# EAGLE design InkTime_Design (EAGLE 9.7.0)

## Sheet 1 of 2
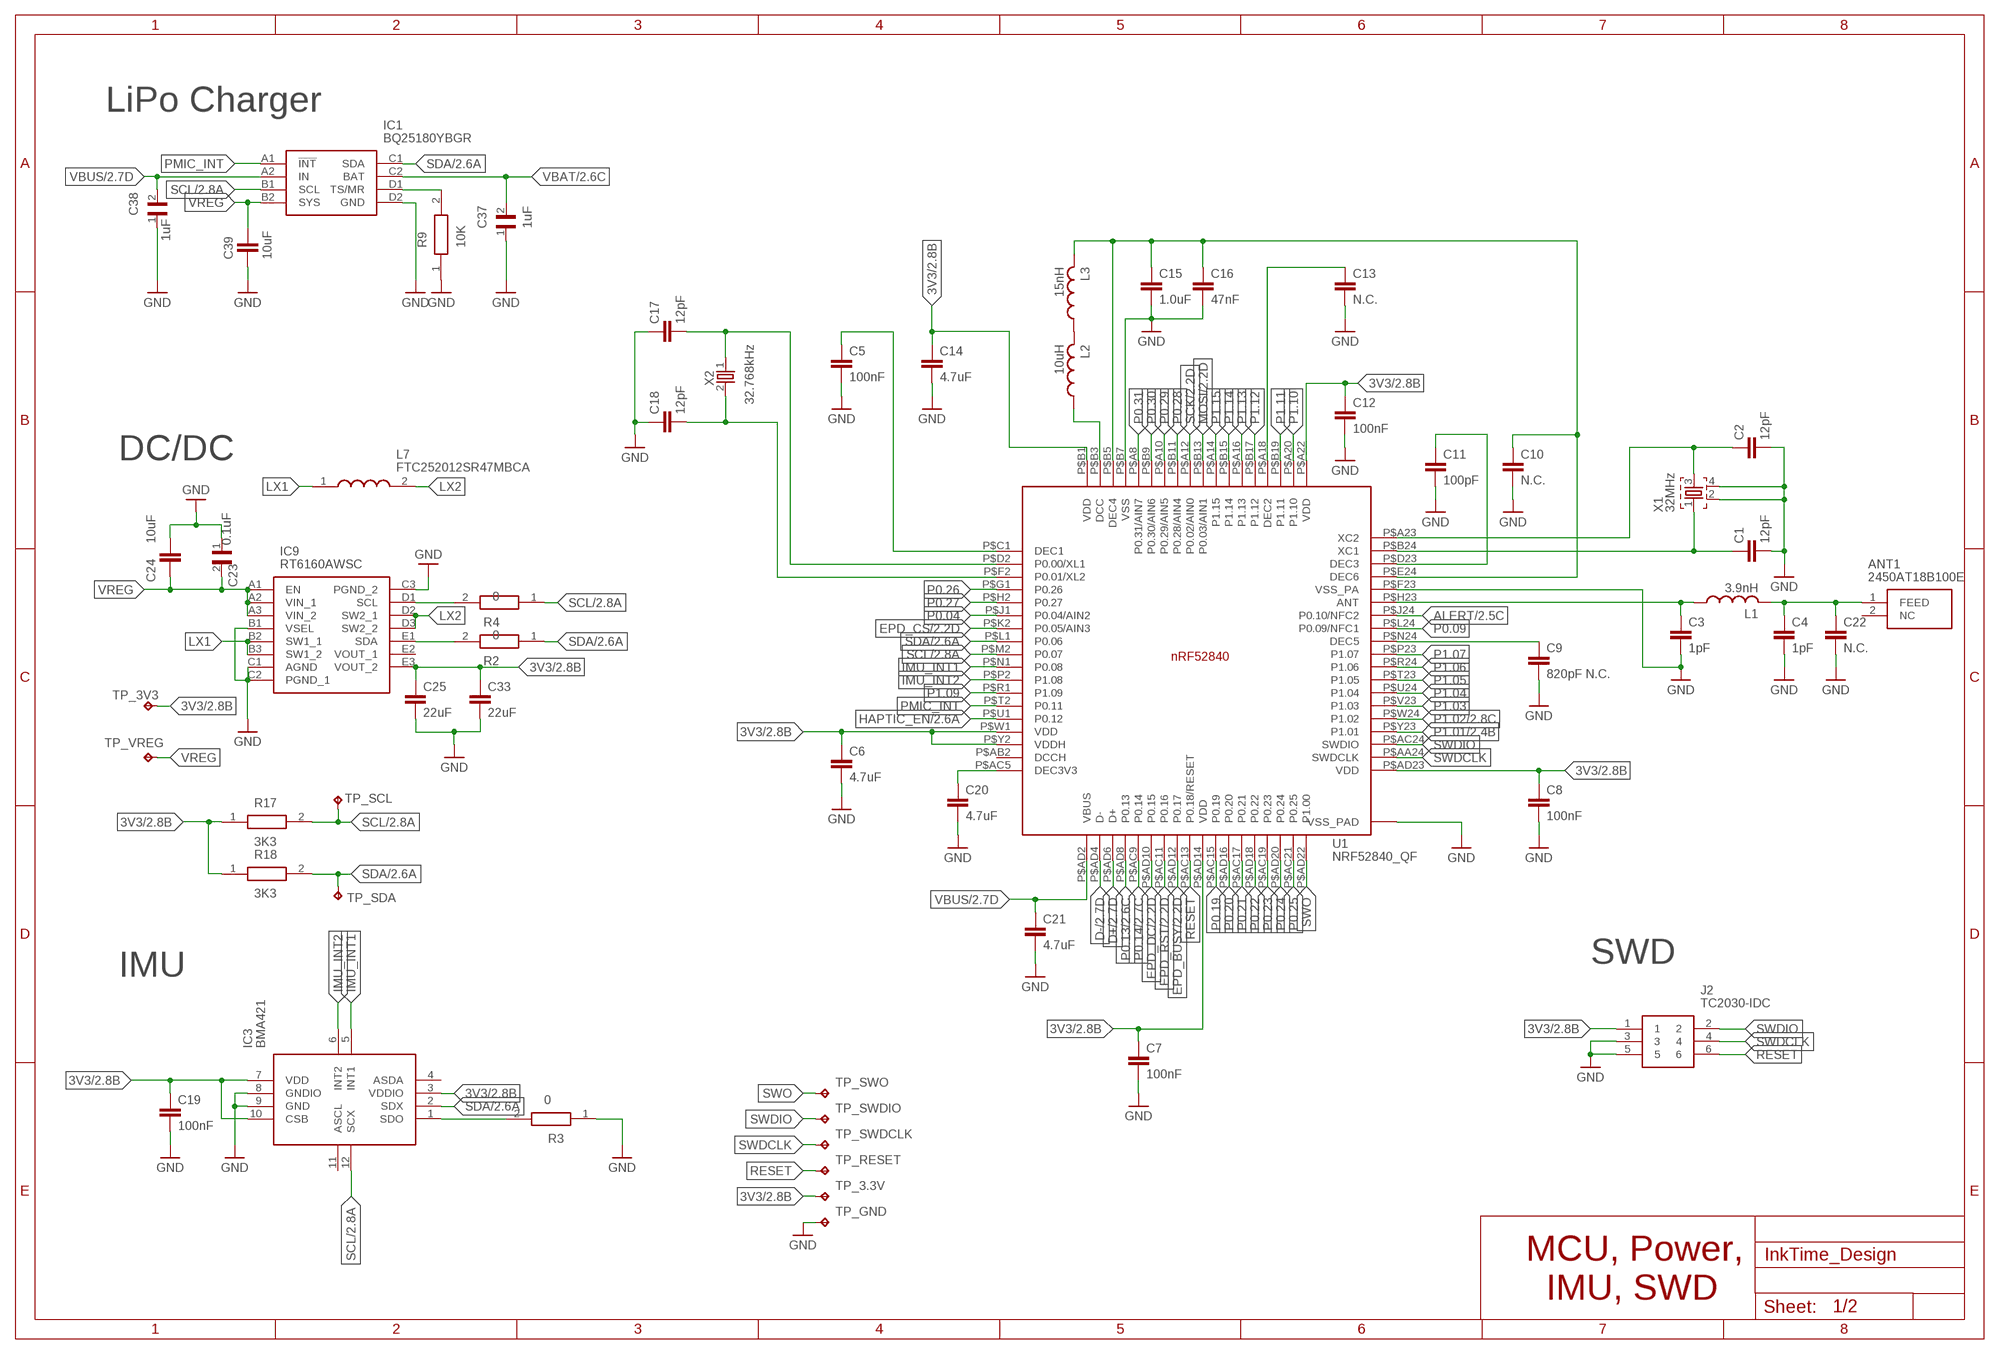
[diagram p0: schematic, sheet 1]

### Parts
ANT1  2450AT18B100E  2450AT18B100E_2450AT18B100E  [2450AT18B100E_ANTC3216X140N]
C1  12pF  NORDIC_NRF_3_CAPACITOR_0201_L  [NORDIC_NRF_3_RESC0201_L]
C2  12pF  NORDIC_NRF_3_CAPACITOR_0201_L  [NORDIC_NRF_3_RESC0201_L]
C3  1pF  NORDIC_NRF_3_CAPACITOR_0201_L  [NORDIC_NRF_3_RESC0201_L]
C4  1pF  NORDIC_NRF_3_CAPACITOR_0201_L  [NORDIC_NRF_3_RESC0201_L]
C5  100nF  NORDIC_NRF_3_CAPACITOR_0201_L  [NORDIC_NRF_3_RESC0201_L]
C6  4.7uF  NORDIC_NRF_3_CAPACITOR_0402_L  [NORDIC_NRF_3_RESC0402_L]
C7  100nF  NORDIC_NRF_3_CAPACITOR_0201_L  [NORDIC_NRF_3_RESC0201_L]
C8  100nF  NORDIC_NRF_3_CAPACITOR_0201_L  [NORDIC_NRF_3_RESC0201_L]
C9  820pF N.C.  NORDIC_NRF_3_CAPACITOR_0201_L  [NORDIC_NRF_3_RESC0201_L]
C10  N.C.  NORDIC_NRF_3_CAPACITOR_0201_L  [NORDIC_NRF_3_RESC0201_L]
C11  100pF  NORDIC_NRF_3_CAPACITOR_0201_L  [NORDIC_NRF_3_RESC0201_L]
C12  100nF  NORDIC_NRF_3_CAPACITOR_0201_L  [NORDIC_NRF_3_RESC0201_L]
C13  N.C.  NORDIC_NRF_3_CAPACITOR_0201_L  [NORDIC_NRF_3_RESC0201_L]
C14  4.7uF  NORDIC_NRF_3_CAPACITOR_0402_L  [NORDIC_NRF_3_RESC0402_L]
C15  1.0uF  NORDIC_NRF_3_CAPACITOR_0402_L  [NORDIC_NRF_3_RESC0402_L]
C16  47nF  NORDIC_NRF_3_CAPACITOR_0201_L  [NORDIC_NRF_3_RESC0201_L]
C17  12pF  NORDIC_NRF_3_CAPACITOR_0201_L  [NORDIC_NRF_3_RESC0201_L]
C18  12pF  NORDIC_NRF_3_CAPACITOR_0201_L  [NORDIC_NRF_3_RESC0201_L]
C19  100nF  NORDIC_NRF_3_CAPACITOR_0201_L  [NORDIC_NRF_3_RESC0201_L]
C20  4.7uF  NORDIC_NRF_3_CAPACITOR_0402_L  [NORDIC_NRF_3_RESC0402_L]
C21  4.7uF  NORDIC_NRF_3_CAPACITOR_0402_L  [NORDIC_NRF_3_RESC0402_L]
C22  N.C.  NORDIC_NRF_3_CAPACITOR_0201_L  [NORDIC_NRF_3_RESC0201_L]
C23  0.1uF  GRM011R60J152KE01L_2_GRM011R60J152KE01L  [GRM011R60J152KE01L_2_CAPC0201X13N]
C24  10uF  NORDIC_NRF_3_CAPACITOR_0402_L  [NORDIC_NRF_3_RESC0402_L]
C25  22uF  NORDIC_NRF_3_CAPACITOR_0402_L  [NORDIC_NRF_3_RESC0402_L]
C33  22uF  NORDIC_NRF_3_CAPACITOR_0402_L  [NORDIC_NRF_3_RESC0402_L]
C37  1uF  GRM011R60J152KE01L_2_GRM011R60J152KE01L  [GRM011R60J152KE01L_2_CAPC0201X13N]
C38  1uF  GRM011R60J152KE01L_2_GRM011R60J152KE01L  [GRM011R60J152KE01L_2_CAPC0201X13N]
C39  10uF  NORDIC_NRF_3_CAPACITOR_0402_L  [NORDIC_NRF_3_RESC0402_L]
IC1  BQ25180YBGR  BQ25180YBGR_BQ25180YBGR  [BQ25180YBGR_BGA8C40P2X4_100X155X50]
IC3  BMA421  BMA423_BMA423  [BMA423_BMA423]
IC9  RT6160AWSC  RT6160AWSC_RT6160AWSC  [RT6160AWSC_BGA15C40P3X5_140X230X60]
J2  TC2030-IDC  TC2030-IDC_TC2030-IDC  [TC2030-IDC_TC2030IDC]
L1  3.9nH  NORDIC_NRF_2_INDUCTOR_0402_L  [NORDIC_NRF_2_RESC0402_L]
L2  10uH  NORDIC_NRF_2_INDUCTOR_0402_L  [NORDIC_NRF_2_RESC0402_L]
L3  15nH  NORDIC_NRF_2_INDUCTOR_0402_L  [NORDIC_NRF_2_RESC0402_L]
L7  FTC252012SR47MBCA  MLP2016SR47MT0S1_FTC252012SR47MBCA  [MLP2016SR47MT0S1_INDC2016X100N]
R2  0  CPF0201D7K68C1_CPF0201D7K68C1  [CPF0201D7K68C1_0201]
R3  0  CPF0201D7K68C1_CPF0201D7K68C1  [CPF0201D7K68C1_0201]
R4  0  CPF0201D7K68C1_CPF0201D7K68C1  [CPF0201D7K68C1_0201]
R9  10K  CPF0201D7K68C1_CPF0201D7K68C1  [CPF0201D7K68C1_0201]
R17  3K3  CPF0201D7K68C1_CPF0201D7K68C1  [CPF0201D7K68C1_0201]
R18  3K3  CPF0201D7K68C1_CPF0201D7K68C1  [CPF0201D7K68C1_0201]
TP_3.3V  HECTOR_WATCH_1_TPTP20R  [HECTOR_WATCH_1_TP20R]
TP_3V3  HECTOR_WATCH_1_TPTP20R  [HECTOR_WATCH_1_TP20R]
TP_GND  HECTOR_WATCH_1_TPTP20R  [HECTOR_WATCH_1_TP20R]
TP_RESET  HECTOR_WATCH_1_TPTP20R  [HECTOR_WATCH_1_TP20R]
TP_SCL  HECTOR_WATCH_1_TPTP20R  [HECTOR_WATCH_1_TP20R]
TP_SDA  HECTOR_WATCH_1_TPTP20R  [HECTOR_WATCH_1_TP20R]
TP_SWDCLK  HECTOR_WATCH_1_TPTP20R  [HECTOR_WATCH_1_TP20R]
TP_SWDIO  HECTOR_WATCH_1_TPTP20R  [HECTOR_WATCH_1_TP20R]
TP_SWO  HECTOR_WATCH_1_TPTP20R  [HECTOR_WATCH_1_TP20R]
TP_VREG  HECTOR_WATCH_1_TPTP20R  [HECTOR_WATCH_1_TP20R]
U1  NRF52840_QF  NORDIC_NRF_4_NRF52840_QF  [NORDIC_NRF_4_AQFN50P700X700X85_HS-74N]
X1  32MHz  NORDIC_NRF_XTAL_32MHZ  [NORDIC_NRF_BT-XTAL_2016_N]
X2  32.768kHz  NORDIC_NRF_1_XTAL_32KHZ  [NORDIC_NRF_1_XTAL_3215_N]

### Nets
3V3 [POWER]: C6.1 C7.1 C8.1 C12.1 C14.1 C19.1 C25.1 C33.1 IC3.3(VDDIO) IC3.7(VDD) IC3.10(CSB) IC9.E3(VOUT_2) J2.1 R17.1 R18.1 TP_3.3V.TP TP_3V3.TP U1.P$A22(VDD) U1.P$AD14(VDD) U1.P$AD23(VDD) U1.P$B1(VDD) U1.P$W1(VDD) U1.P$Y2(VDDH) ; also sheet 2
ALERT: U1.P$J24(P0.10/NFC2) ; also sheet 2
D+: U1.P$AD6(D+) ; also sheet 2
D-: U1.P$AD4(D-) ; also sheet 2
EPD_BUSY: U1.P$AD12(P0.17) ; also sheet 2
EPD_CS: U1.P$K2(P0.05/AIN3) ; also sheet 2
EPD_DC: U1.P$AD10(P0.15) ; also sheet 2
EPD_RST: U1.P$AC11(P0.16) ; also sheet 2
GND: C1.2 C2.2 C3.2 C4.2 C5.2 C6.2 C7.2 C8.2 C9.2 C10.2 C11.2 C12.2 C13.2 C14.2 C15.2 C16.2 C17.1 C18.1 C19.2 C20.2 C21.2 C22.2 C23.1 C24.1 C25.2 C33.2 C37.1 C38.1 C39.2 IC1.D2(GND) IC3.8(GNDIO) IC3.9(GND) IC9.B1(VSEL) IC9.C1(AGND) IC9.C2(PGND_1) IC9.C3(PGND_2) J2.3 J2.5 R3.1 R9.1 TP_GND.TP U1.P$74(VSS_PAD) U1.P$75(VSS_PAD) U1.P$76(VSS_PAD) U1.P$77(VSS_PAD) U1.P$78(VSS_PAD) U1.P$79(VSS_PAD) U1.P$80(VSS_PAD) U1.P$81(VSS_PAD) U1.P$82(VSS_PAD) U1.P$83(VSS_PAD) U1.P$84(VSS_PAD) U1.P$85(VSS_PAD) U1.P$86(VSS_PAD) U1.P$87(VSS_PAD) U1.P$88(VSS_PAD) U1.P$89(VSS_PAD) U1.P$90(VSS_PAD) U1.P$B7(VSS) U1.P$F23(VSS_PA) X1.2 X1.4 ; also sheet 2
HAPTIC_EN: U1.P$U1(P0.12) ; also sheet 2
IMU_INT1: IC3.5(INT1) U1.P$N1(P0.08)
IMU_INT2: IC3.6(INT2) U1.P$P2(P1.08)
LX1: IC9.B2(SW1_1) IC9.B3(SW1_2) L7.1
LX2: IC9.D2(SW2_1) IC9.D3(SW2_2) L7.2
MOSI: U1.P$B13(P0.03/AIN1) ; also sheet 2
N$1: IC9.D1(SCL) R4.2
N$2: IC9.E1(SDA) R2.2
N$3: IC3.1(SDO) R3.2
N$4: IC1.D1(TS/MR) R9.2
N$5: C9.1 U1.P$N24(DEC5)
N$6: ANT1.1(FEED) C4.1 C22.1 L1.2
N$7: C3.1 L1.1 U1.P$H23(ANT)
N$8: C1.1 U1.P$B24(XC1) X1.1
N$9: C2.1 U1.P$A23(XC2) X1.3
N$10: C11.1 U1.P$D23(DEC3)
N$11: C13.1 U1.P$A18(DEC2)
N$12: L2.2 L3.1
N$13: L2.1 U1.P$B3(DCC)
N$14: C10.1 C15.1 C16.1 L3.2 U1.P$B5(DEC4) U1.P$E24(DEC6)
N$15: C17.2 U1.P$D2(P0.00/XL1) X2.1
N$16: C5.1 U1.P$C1(DEC1)
N$17: C18.2 U1.P$F2(P0.01/XL2) X2.2
N$18: C20.1 U1.P$AC5(DEC3V3)
P0.04: U1.P$J1(P0.04/AIN2)
P0.09: U1.P$L24(P0.09/NFC1)
P0.13: U1.P$AD8(P0.13) ; also sheet 2
P0.14: U1.P$AC9(P0.14) ; also sheet 2
P0.19: U1.P$AC15(P0.19)
P0.20: U1.P$AD16(P0.20)
P0.21: U1.P$AC17(P0.21)
P0.22: U1.P$AD18(P0.22)
P0.23: U1.P$AC19(P0.23)
P0.24: U1.P$AD20(P0.24)
P0.25: U1.P$AC21(P0.25)
P0.26: U1.P$G1(P0.26)
P0.27: U1.P$H2(P0.27)
P0.28: U1.P$B11(P0.28/AIN4)
P0.29: U1.P$A10(P0.29/AIN5)
P0.30: U1.P$B9(P0.30/AIN6)
P0.31: U1.P$A8(P0.31/AIN7)
P1.01: U1.P$Y23(P1.01) ; also sheet 2
P1.02: U1.P$W24(P1.02) ; also sheet 2
P1.03: U1.P$V23(P1.03)
P1.04: U1.P$U24(P1.04)
P1.05: U1.P$T23(P1.05)
P1.06: U1.P$R24(P1.06)
P1.07: U1.P$P23(P1.07)
P1.09: U1.P$R1(P1.09)
P1.10: U1.P$A20(P1.10)
P1.11: U1.P$B19(P1.11)
P1.12: U1.P$B17(P1.12)
P1.13: U1.P$A16(P1.13)
P1.14: U1.P$B15(P1.14)
P1.15: U1.P$A14(P1.15)
PMIC_INT: IC1.A1(!INT) U1.P$T2(P0.11)
RESET: J2.6 TP_RESET.TP U1.P$AC13(P0.18/RESET)
SCK: U1.P$A12(P0.02/AIN0) ; also sheet 2
SCL: IC1.B1(SCL) IC3.12(SCX) R4.1 R17.2 TP_SCL.TP U1.P$M2(P0.07) ; also sheet 2
SDA: IC1.C1(SDA) IC3.2(SDX) R2.1 R18.2 TP_SDA.TP U1.P$L1(P0.06) ; also sheet 2
SWDCLK: J2.4 TP_SWDCLK.TP U1.P$AA24(SWDCLK)
SWDIO: J2.2 TP_SWDIO.TP U1.P$AC24(SWDIO)
SWO: TP_SWO.TP U1.P$AD22(P1.00)
VBAT [POWER]: C37.2 IC1.C2(BAT) ; also sheet 2
VBUS [POWER]: C21.1 C38.2 IC1.A2(IN) U1.P$AD2(VBUS) ; also sheet 2
VREG [POWER]: C23.2 C24.2 C39.1 IC1.B2(SYS) IC9.A1(EN) IC9.A2(VIN_1) IC9.A3(VIN_2) TP_VREG.TP
Unconnected: ANT1.2(NC) IC3.4(ASDA) IC3.11(ASCL) IC9.E2(VOUT_1) U1.P$AB2(DCCH)

### Notes on the sheet
- LiPo Charger
- DC/DC
- SWD
- IMU
- MCU, Power,
    IMU, SWD

## Sheet 2 of 2
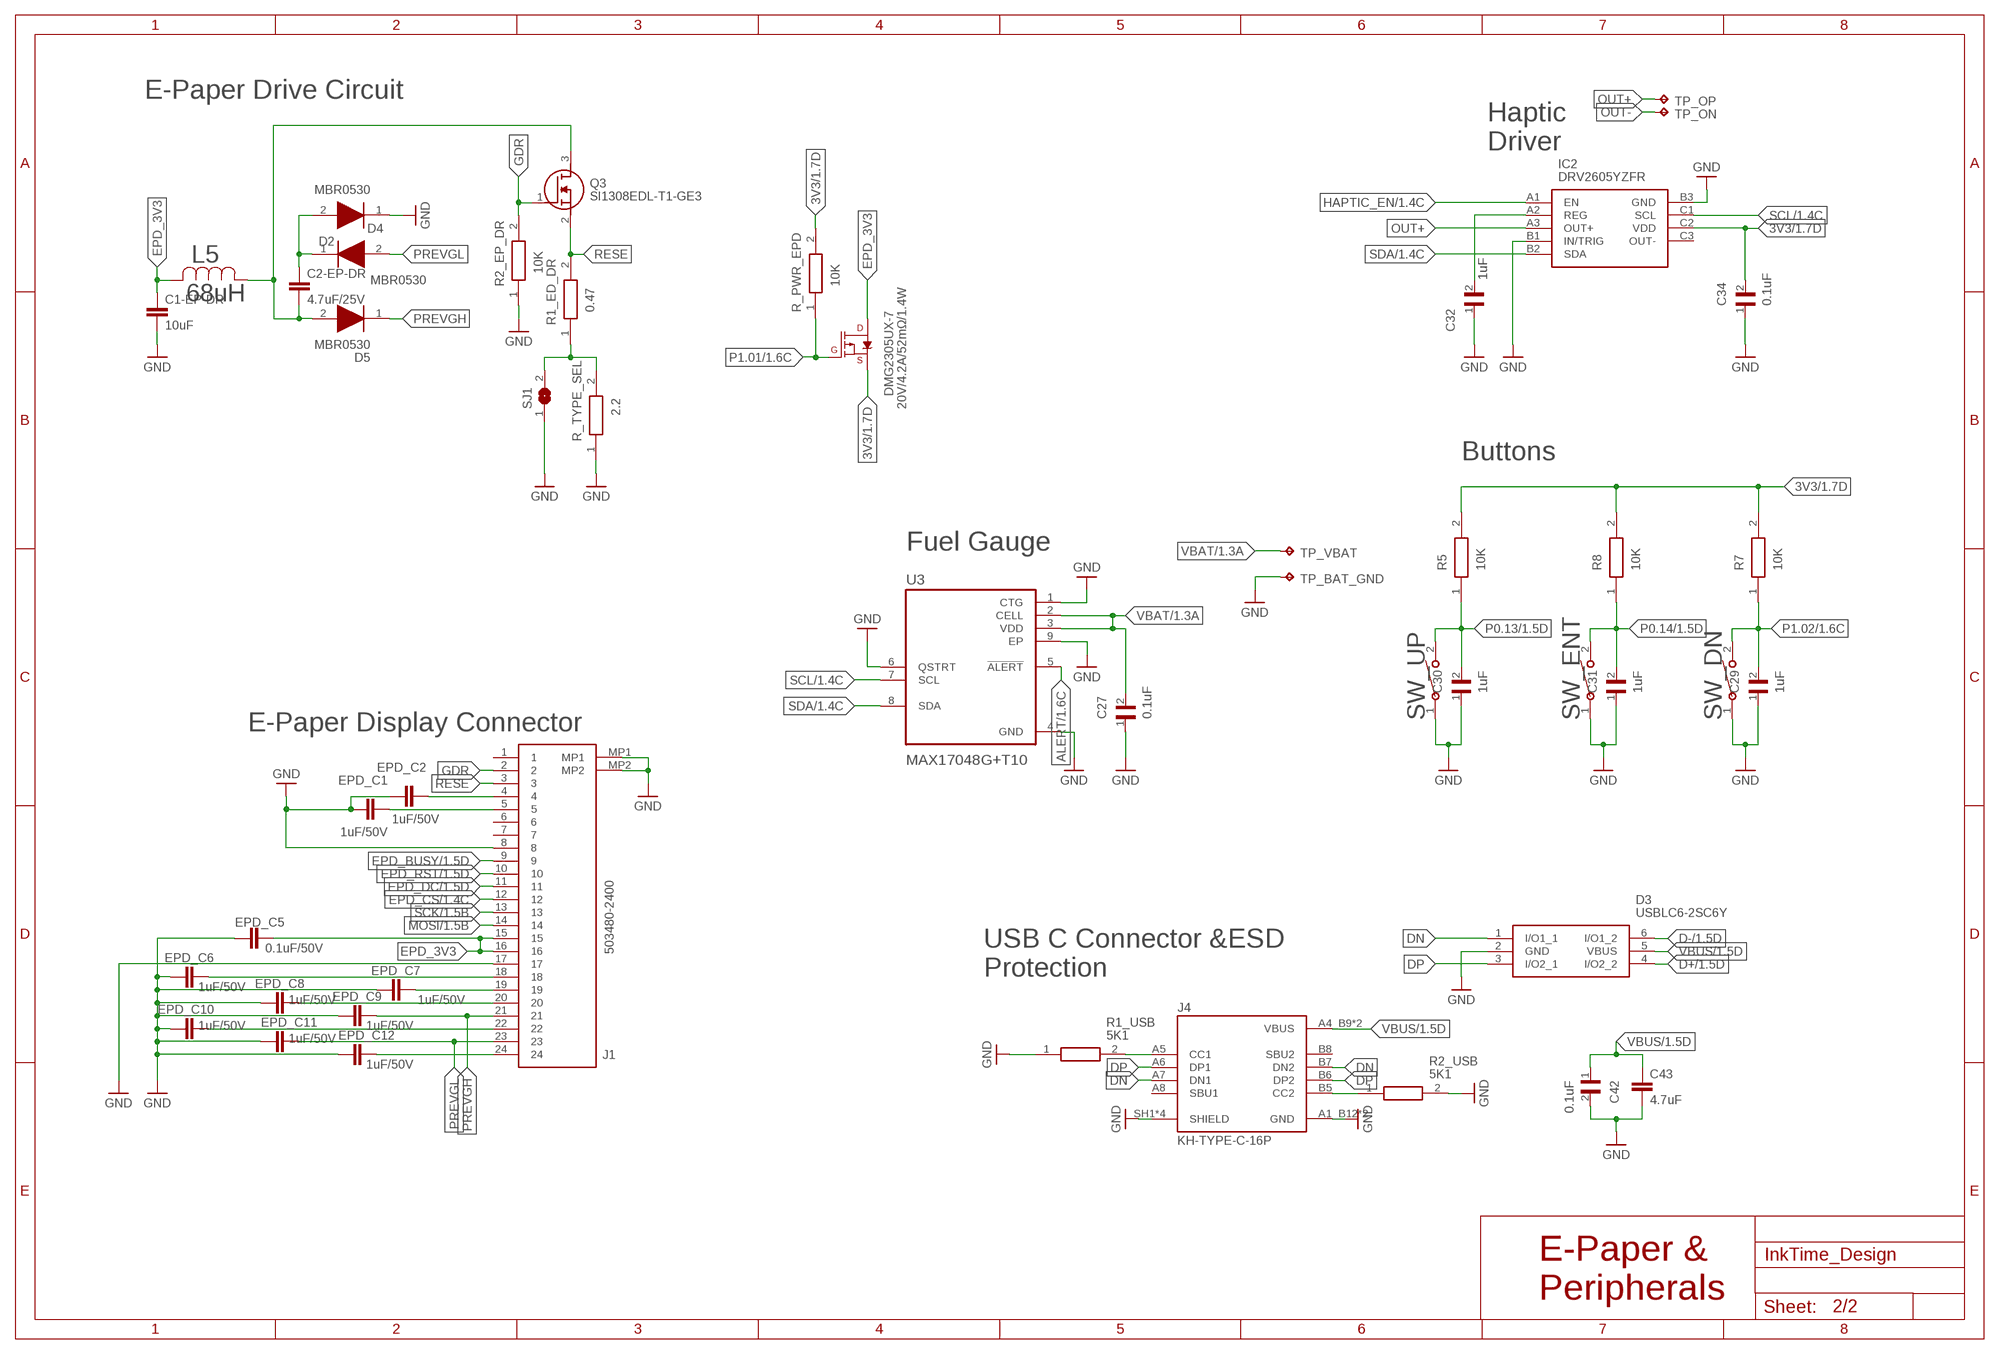
[diagram p1: schematic, sheet 2]

### Parts
C1-EP-DR  10uF  NORDIC_NRF_3_CAPACITOR_0402_L  [NORDIC_NRF_3_RESC0402_L]
C2-EP-DR  4.7uF/25V  NORDIC_NRF_3_CAPACITOR_0402_L  [NORDIC_NRF_3_RESC0402_L]
C27  0.1uF  GRM011R60J152KE01L_1_GRM011R60J152KE01L  [GRM011R60J152KE01L_1_0201]
C29  1uF  GRM011R60J152KE01L_1_GRM011R60J152KE01L  [GRM011R60J152KE01L_1_0201]
C30  1uF  GRM011R60J152KE01L_1_GRM011R60J152KE01L  [GRM011R60J152KE01L_1_0201]
C31  1uF  GRM011R60J152KE01L_1_GRM011R60J152KE01L  [GRM011R60J152KE01L_1_0201]
C32  1uF  GRM011R60J152KE01L_1_GRM011R60J152KE01L  [GRM011R60J152KE01L_1_0201]
C34  0.1uF  GRM011R60J152KE01L_1_GRM011R60J152KE01L  [GRM011R60J152KE01L_1_0201]
C42  0.1uF  GRM011R60J152KE01L_1_GRM011R60J152KE01L  [GRM011R60J152KE01L_1_0201]
C43  4.7uF  NORDIC_NRF_3_CAPACITOR_0402_L  [NORDIC_NRF_3_RESC0402_L]
D2  MBR0530  ESP32_C6_LIBRARY_5_MBR0530  [ESP32_C6_LIBRARY_5_SOD3716X135N]
D3  USBLC6-2SC6Y  ESP32_C6_LIBRARY_3_USBLC6-2SC6Y  [ESP32_C6_LIBRARY_3_SOT95P280X145-6N]
D4  MBR0530  ESP32_C6_LIBRARY_5_MBR0530  [ESP32_C6_LIBRARY_5_SOD3716X135N]
D5  MBR0530  ESP32_C6_LIBRARY_5_MBR0530  [ESP32_C6_LIBRARY_5_SOD3716X135N]
DMG2305UX-7  20V/4.2A/52mΩ/1.4W  ESP32_C6_LIBRARY_4_ESP32_WROVER_SPARKFUN-DISCRETESEMI_MOSFET_PCH-DMG2305UX-7  [ESP32_C6_LIBRARY_4_ESP32_C6_LIBRARY_4_ESP32_C6_LIBRARY_4_ESP32_C6_LIBRARY_4_ESP32_WROVER_SPARKFUN-DISCRETESEMI_SOT23-3]
EPD_C1  1uF/50V  NORDIC_NRF_3_CAPACITOR_0402_L  [NORDIC_NRF_3_RESC0402_L]
EPD_C2  1uF/50V  NORDIC_NRF_3_CAPACITOR_0402_L  [NORDIC_NRF_3_RESC0402_L]
EPD_C5  0.1uF/50V  NORDIC_NRF_3_CAPACITOR_0402_L  [NORDIC_NRF_3_RESC0402_L]
EPD_C6  1uF/50V  NORDIC_NRF_3_CAPACITOR_0402_L  [NORDIC_NRF_3_RESC0402_L]
EPD_C7  1uF/50V  NORDIC_NRF_3_CAPACITOR_0402_L  [NORDIC_NRF_3_RESC0402_L]
EPD_C8  1uF/50V  NORDIC_NRF_3_CAPACITOR_0402_L  [NORDIC_NRF_3_RESC0402_L]
EPD_C9  1uF/50V  NORDIC_NRF_3_CAPACITOR_0402_L  [NORDIC_NRF_3_RESC0402_L]
EPD_C10  1uF/50V  NORDIC_NRF_3_CAPACITOR_0402_L  [NORDIC_NRF_3_RESC0402_L]
EPD_C11  1uF/50V  NORDIC_NRF_3_CAPACITOR_0402_L  [NORDIC_NRF_3_RESC0402_L]
EPD_C12  1uF/50V  NORDIC_NRF_3_CAPACITOR_0402_L  [NORDIC_NRF_3_RESC0402_L]
IC2  DRV2605YZFR  DRV2605YZFR_DRV2605YZFR  [DRV2605YZFR_BGA9C50P3X3_144X144X62]
J1  503480-2400  503480-2400_503480-2400  [503480-2400_5034802400]
J4  KH-TYPE-C-16P  KH-TYPE-C-16P_KH-TYPE-C-16P  [KH-TYPE-C-16P_KINGHELM_KH-TYPE-C-16P]
L5  68uH  ESP32_C6_LIBRARY_2_744043680IND_4828-WE-TPC_WRE  [ESP32_C6_LIBRARY_2_IND_4828-WE-TPC_WRE]
Q3  SI1308EDL-T1-GE3  ESP32_C6_LIBRARY_6_SI1308EDL-T1-GE3  [ESP32_C6_LIBRARY_6_SOT65P210X110-3N]
R1_ED_DR  0.47  CPF0201D7K68C1_CPF0201D7K68C1  [CPF0201D7K68C1_0201]
R1_USB  5K1  CPF0201D7K68C1_CPF0201D7K68C1  [CPF0201D7K68C1_0201]
R2_EP_DR  10K  CPF0201D7K68C1_CPF0201D7K68C1  [CPF0201D7K68C1_0201]
R2_USB  5K1  CPF0201D7K68C1_CPF0201D7K68C1  [CPF0201D7K68C1_0201]
R5  10K  CPF0201D7K68C1_CPF0201D7K68C1  [CPF0201D7K68C1_0201]
R7  10K  CPF0201D7K68C1_CPF0201D7K68C1  [CPF0201D7K68C1_0201]
R8  10K  CPF0201D7K68C1_CPF0201D7K68C1  [CPF0201D7K68C1_0201]
R_PWR_EPD  10K  CPF0201D7K68C1_CPF0201D7K68C1  [CPF0201D7K68C1_0201]
R_TYPE_SEL  2.2  CPF0201D7K68C1_CPF0201D7K68C1  [CPF0201D7K68C1_0201]
SJ1  ESP32_C6_LIBRARY_7_JUMPER_SJ  [ESP32_C6_LIBRARY_7_JUMPER_SJ]
SW_DN  2025-10-22_07-23-44_LIBRARY_EVP-AKE31ASW_EVP-AKE31A_PAN  [2025-10-22_07-23-44_LIBRARY_SW_EVP-AKE31A_PAN]
SW_ENT  2025-10-22_07-23-44_LIBRARY_EVP-AKE31ASW_EVP-AKE31A_PAN  [2025-10-22_07-23-44_LIBRARY_SW_EVP-AKE31A_PAN]
SW_UP  2025-10-22_07-23-44_LIBRARY_EVP-AKE31ASW_EVP-AKE31A_PAN  [2025-10-22_07-23-44_LIBRARY_SW_EVP-AKE31A_PAN]
TP_BAT_GND  HECTOR_WATCH_1_TPTP20R  [HECTOR_WATCH_1_TP20R]
TP_ON  HECTOR_WATCH_1_TPTP20R  [HECTOR_WATCH_1_TP20R]
TP_OP  HECTOR_WATCH_1_TPTP20R  [HECTOR_WATCH_1_TP20R]
TP_VBAT  HECTOR_WATCH_1_TPTP20R  [HECTOR_WATCH_1_TP20R]
U3  MAX17048G+T10  ESP32_C6_LIBRARY_MAX17048G+T10  [ESP32_C6_LIBRARY_SON50P200X200X80-9N]

### Nets
3V3 [POWER]: C34.2 DMG2305UX-7.2(S) IC2.C2(VDD) R5.2 R7.2 R8.2 R_PWR_EPD.2 ; also sheet 1
ALERT: U3.5(!ALERT) ; also sheet 1
D+: D3.4(I/O2_2) ; also sheet 1
D-: D3.6(I/O1_2) ; also sheet 1
DN: D3.1(I/O1_1) J4.A7(DN1) J4.B7(DN2)
DP: D3.3(I/O2_1) J4.A6(DP1) J4.B6(DP2)
EPD_3V3 [POWER]: C1-EP-DR.1 DMG2305UX-7.3(D) EPD_C5.2 J1.15 J1.16 L5.2
EPD_BUSY: J1.9 ; also sheet 1
EPD_CS: J1.12 ; also sheet 1
EPD_DC: J1.11 ; also sheet 1
EPD_RST: J1.10 ; also sheet 1
GDR: J1.2 Q3.1(G) R2_EP_DR.2
GND: C1-EP-DR.2 C27.1 C29.1 C30.1 C31.1 C32.1 C34.1 C42.2 C43.2 D3.2(GND) D4.1(K) EPD_C1.1 EPD_C2.1 EPD_C5.1 EPD_C6.1 EPD_C7.1 EPD_C8.1 EPD_C9.1 EPD_C10.1 EPD_C11.1 EPD_C12.1 IC2.B1(IN/TRIG) IC2.B3(GND) J1.8 J1.17 J1.MP1 J1.MP2 J4.A1_B12(GND) J4.A12_B1(GND) J4.SH1(SHIELD) J4.SH2(SHIELD) J4.SH3(SHIELD) J4.SH4(SHIELD) R1_USB.1 R2_EP_DR.1 R2_USB.2 R_TYPE_SEL.1 SJ1.1 SW_DN.1 SW_ENT.1 SW_UP.1 TP_BAT_GND.TP U3.1(CTG) U3.4(GND) U3.6(QSTRT) U3.9(EP) ; also sheet 1
HAPTIC_EN: IC2.A1(EN) ; also sheet 1
MOSI: J1.14 ; also sheet 1
N$19: C2-EP-DR.2 D5.2(A) L5.1 Q3.3(D)
N$20: C2-EP-DR.1 D2.1(K) D4.2(A)
N$21: R1_ED_DR.1 R_TYPE_SEL.2 SJ1.2
N$22: EPD_C2.2 J1.4
N$23: EPD_C1.2 J1.5
N$24: C32.2 IC2.A2(REG)
N$25: J4.A5(CC1) R1_USB.2
N$26: EPD_C6.2 J1.18
N$27: EPD_C7.2 J1.19
N$28: EPD_C10.2 J1.22
N$29: EPD_C8.2 J1.20
N$30: J4.B5(CC2) R2_USB.1
N$32: EPD_C12.2 J1.24
OUT+: IC2.A3(OUT+) TP_OP.TP
OUT-: TP_ON.TP
P0.13: C30.2 R5.1 SW_UP.2 ; also sheet 1
P0.14: C31.2 R8.1 SW_ENT.2 ; also sheet 1
P1.01: DMG2305UX-7.1(G) R_PWR_EPD.1 ; also sheet 1
P1.02: C29.2 R7.1 SW_DN.2 ; also sheet 1
PREVGH: D5.1(K) EPD_C9.2 J1.21
PREVGL: D2.2(A) EPD_C11.2 J1.23
RESE: J1.3 Q3.2(S) R1_ED_DR.2
SCK: J1.13 ; also sheet 1
SCL: IC2.C1(SCL) U3.7(SCL) ; also sheet 1
SDA: IC2.B2(SDA) U3.8(SDA) ; also sheet 1
VBAT [POWER]: C27.2 TP_VBAT.TP U3.2(CELL) U3.3(VDD) ; also sheet 1
VBUS [POWER]: C42.1 C43.1 D3.5(VBUS) J4.A4_B9(VBUS) J4.A9_B4(VBUS) ; also sheet 1
Unconnected: IC2.C3(OUT-) J1.1 J1.6 J1.7 J4.A8(SBU1) J4.B8(SBU2)

### Notes on the sheet
- E-Paper Drive Circuit
- Haptic
  Driver
- Buttons
- Fuel Gauge
- E-Paper Display Connector
- USB C Connector &ESD
  Protection
- E-Paper &
  Peripherals

## Library data of the parts
ANT1 = InkTime_v5:2450AT18B100E_2450AT18B100E: Antennas 2.45GHz ANTENNA Source: Datasheet <https://www.johansontechnology.com/datasheets/2450AT18B100/2450AT18B100.pdf>
C1 C1-EP-DR C2 C2-EP-DR C3-C22 C24 C25 C33 C39 C43 EPD_C1 EPD_C2 EPD_C5-EPD_C12 = InkTime_v5:NORDIC_NRF_3_CAPACITOR: Generic chip capacitor
C23 C37 C38 = InkTime_v5:GRM011R60J152KE01L_2_GRM011R60J152KE01L: Check availability <https://pricing.snapeda.com/parts/GRM011R60J152KE01L/Murata/view-part?ref=eda>
C27 C29-C32 C34 C42 = InkTime_v5:GRM011R60J152KE01L_1_GRM011R60J152KE01L: Check availability <https://pricing.snapeda.com/parts/GRM011R60J152KE01L/Murata/view-part?ref=eda>
D2 D4 D5 = InkTime_v5:ESP32_C6_LIBRARY_5_MBR0530: ON SEMICONDUCTOR - MBR0530 - DIODE, SCHOTTKY, 0.5A, 30V, SOD-123 Source: Datasheet <http://www.onsemi.com/pub/Collateral/MBR0530T1-D.PDF> Check availability <https://pricing.snapeda.com/parts/MBR0530/ON%20Semiconductor/view-part?ref=eda>
D3 = InkTime_v5:ESP32_C6_LIBRARY_3_USBLC6-2SC6Y: Low Cap. ESD Protection Auto SOT-23-6 STMicroelectronics USBLC6-2SC6Y, Dual Uni-Directional TVS Diode Array, 6-Pin SOT-23 Source: Datasheet <https://componentsearchengine.com/Datasheets/1/USBLC6-2SC6Y.pdf> Check availability <https://pricing.snapeda.com/parts/USBLC6-2SC6Y/STMicroelectronics/view-part?ref=eda>
DMG2305UX-7 = InkTime_v5:ESP32_C6_LIBRARY_4_ESP32_WROVER_SPARKFUN-DISCRETESEMI_MOSFET_PCH: P-channel MOSFETs Voltage controlled devices that allow control of high current outputs. SparkFun Products: SparkFun ESP32 Thing <https://www.sparkfun.com/products/13907> SparkFun ESP8266 Thing <https://www.sparkfun.com/products/13231> SparkFun Pi Servo HAT V2 <https://www.sparkfun.com/products/15316> DMG2305UX-7 (20V/4.2A/SOT23-3)
IC1 = InkTime_v5:BQ25180YBGR_BQ25180YBGR: Charger IC Lithium Ion/Polymer, Lithium Iron Phosphate 8-DSBGA (1.6x1.1) Source: Datasheet <https://www.ti.com/lit/ds/symlink/bq25180.pdf?ts=1650264094470&ref_url=https%3A%2F%2Fwww.ti.com%2Fproduct%2FBQ25180>
IC2 = InkTime_v5:DRV2605YZFR_DRV2605YZFR: Haptic Driver for ERM/LRA with Built-In Library and Smart Loop Architecture Source: Datasheet <http://www.ti.com/lit/gpn/drv2605>
IC3 = InkTime_v5:BMA423_BMA423: Accelerometers Triaxial low-g 12bit Acceleration Sensor Source: Datasheet <https://www.mouser.com/datasheet/2/783/BST-BMA423-DS000-1509600.pdf>
IC9 = InkTime_v5:RT6160AWSC_RT6160AWSC: Buck-Boost Regulator Positive Output Step-Up/Step-Down I2C DC-DC Controller IC 15-WL-CSP (BSC) (1.4x2.3) Source: Datasheet <https://www.richtek.com/SaveDownload.aspx?specid=RT6160A>
J1 = InkTime_v5:503480-2400_503480-2400: FFC & FPC Connectors 0.5mm FPC RA SMT Dual Contact 24Ckt Source: Datasheet <https://componentsearchengine.com/Datasheets/1/503480-2400.pdf>
J2 = InkTime_v5:TC2030-IDC_TC2030-IDC: CABLE ADAPTER 6 POS Source: Datasheet <https://datasheet.datasheetarchive.com/originals/distributors/Datasheets_SAMA/62bc384e093448baaaa63dbd0b9d8707.pdf>
J4 = InkTime_v5:KH-TYPE-C-16P_KH-TYPE-C-16P: Check availability <https://pricing.snapeda.com/parts/KH-TYPE-C-16P/kinghelm/view-part?ref=eda>
L1-L3 = InkTime_v5:NORDIC_NRF_2_INDUCTOR: Generic chip inductor
L5 = InkTime_v5:ESP32_C6_LIBRARY_2_744043680
L7 = InkTime_v5:MLP2016SR47MT0S1_FTC252012SR47MBCA: SMD / SMT Inductors (Coils), L=0.47?H, L x W x T : Source: Datasheet <https://product.tdk.com/system/files/dam/doc/product/inductor/inductor/smd/catalog/inductor_commercial_power_mlp2016_en.pdf>
Q3 = InkTime_v5:ESP32_C6_LIBRARY_6_SI1308EDL-T1-GE3: MOSFET N-Ch 30V 1.5A TrenchFET SC70 Vishay Si1308EDL-T1-GE3 N-channel MOSFET Transistor, 1.5 A, 30 V, 3-Pin SC-70 Source: Datasheet <https://componentsearchengine.com/Datasheets/1/SI1308EDL-T1-GE3.pdf> Check availability <https://pricing.snapeda.com/parts/SI1308EDL-T1-GE3/Vishay%20Siliconix/view-part?ref=eda>
R1_ED_DR R2 R2_EP_DR R2_USB R3-R5 R7-R9 R17 R18 R_PWR_EPD R_TYPE_SEL = InkTime_v5:CPF0201D7K68C1_CPF0201D7K68C1: 7.68k 0201 Thin Film Surface Mount Fixed Resistor +/-0.5% 0.031W CPF0201D7K68C1 Source: Datasheet <http://www.te.com/commerce/DocumentDelivery/DDEController?Action=showdoc&DocId=Data Sheet1773200-1ApdfEnglishENG_DS_1773200-1_A.pdf4-2176215-6>
R1_USB = InkTime_v5:CPF0201D7K68C1_CPF0201D7K68C1: 7.68k 0201 Thin Film Surface Mount Fixed Resistor +/-0.5% 0.031W CPF0201D7K68C1 Source: Datasheet <http://www.te.com/commerce/DocumentDelivery/DDEController?Action=showdoc&DocId=Data Sheet1773200-1ApdfEnglishENG_DS_1773200-1_A.pdf4-2176215-6>; SPICEPREFIX: R
SJ1 = InkTime_v5:ESP32_C6_LIBRARY_7_JUMPER_SJ: SMD solder JUMPER
SW_DN SW_ENT SW_UP = InkTime_v5:2025-10-22_07-23-44_LIBRARY_EVP-AKE31A
TP_3.3V TP_3V3 TP_BAT_GND TP_GND TP_ON TP_OP TP_RESET TP_SCL TP_SDA TP_SWDCLK TP_SWDIO TP_SWO TP_VBAT TP_VREG = InkTime_v5:HECTOR_WATCH_1_TP: Test pad
U1 = InkTime_v5:NORDIC_NRF_4_NRF52840_QF: nRF52840 Features Advanced Single chip 2.4 GHz multi-protocol SoC 32-bit ARM Cortex-M4F Processor 1.7v to 5.5v operation 1MB flash + 256kB RAM Bluetooth 5 support for long range and high throughput 802.15.4 radio support On-chip NFC PPI –Programmable Peripheral Interconnect Automated power management system with automatic power management of each peripheral Configurable I/O mapping for analog and digital I/O 48 x GPIO 1 x QSPI 4 x Master/Slave SPI 2 x Two-wire interface (I²C) I²S interface 2 x UART 4 x PWM USB 2.0 controller ARM TrustZone CryptoCell-310 Cryptographic and security module AES 128-bit ECB/CCM/AAR hardware accelerator Digital microphone interface (PDM) Quadrature decoder 12-bit ADC Low power comparator On-chip 50Ω balun On-air compatible with nRF52, nRF51 and nRF24 Series Applications Advanced high performance wearables Wearables for secure payments Virtual Reality/Augmented Reality systems Smart Home sensor networks Smart city sensor networks High performance HID controllers Internet of Things (IoT) sensor networks Smart door locks Smart lighting networks Connected white goods
U3 = InkTime_v5:ESP32_C6_LIBRARY_MAX17048G+T10: Check availability <https://pricing.snapeda.com/parts/MAX17048G%2BT10/Analog%20Devices/view-part?ref=eda>
X1 = InkTime_v5:NORDIC_NRF_XTAL_32MHZ
X2 = InkTime_v5:NORDIC_NRF_1_XTAL_32KHZ

## Net classes
0 default: width 0.15 mm
1 POWER: width 0.3 mm

## Board
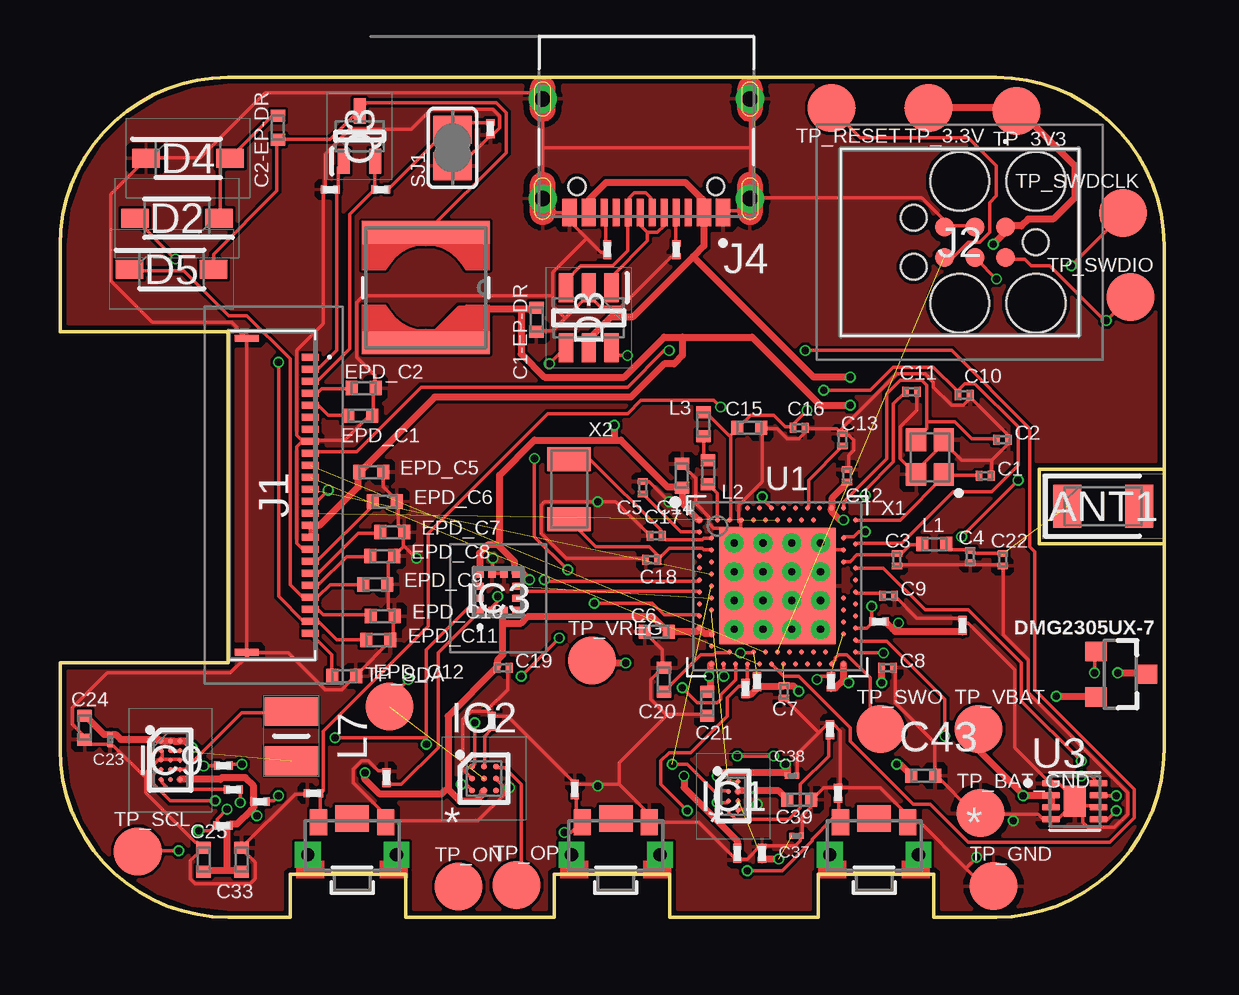
[diagram p2: board, top side]
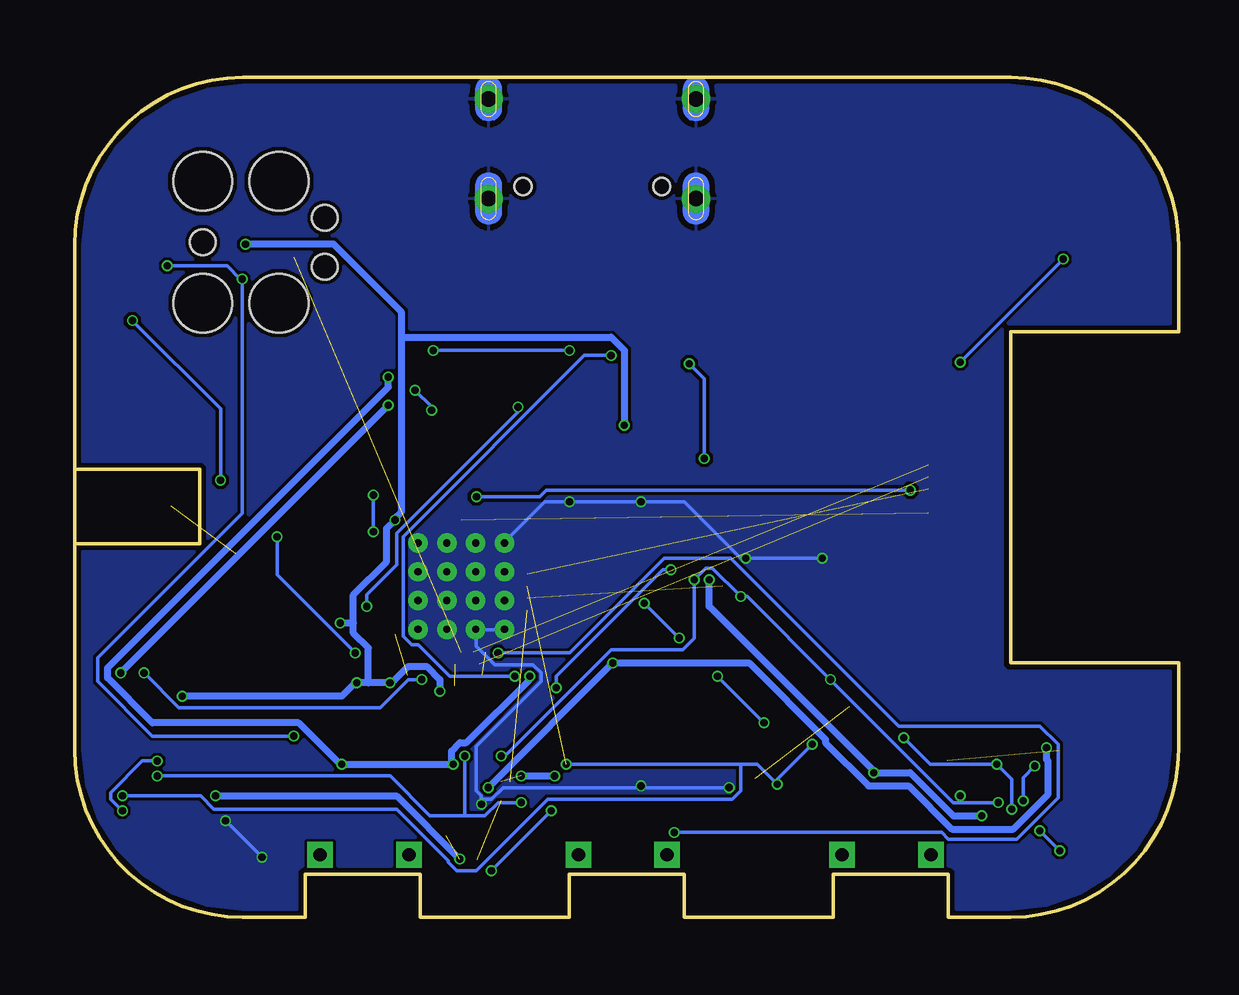
[diagram p3: board, bottom side, seen from below]

Size 46 x 35 mm. Coordinates in mm from the lower left corner, seen from the top.
Outline: 46,15.57 46,7 arc-90 39,0 36.4,0 36.4,1.8 31.6,1.8 31.6,0 25.4,0 25.4,1.8 20.6,1.8 20.6,0 14.4,0 14.4,1.8 9.6,1.8 9.6,0 7,0 arc-90 0,7 0,10.6 7,10.6 7,24.4 0,24.4 0,28 arc-90 7,35 39,35 arc-90 46,28 46,18.66
Outline: 46,15.57 46,18.66
Outline: 46,18.66 40.8,18.66 40.8,15.57 46,15.57
Copper layers (1*16): Top / Bottom
Stack-up Default Layer Stack: Top User Defined 0.035mm / Dielectric-1 User Defined 1.6mm / Bottom User Defined 0.035mm
Design rules: minimum copper width classes=1 0.3mm, minimum copper width classes=0 0.15mm, minimum copper width 5mil, minimum drill size 0.3mm, copper clearance wire_polygon to wire_polygon 5mil, copper clearance wire_polygon to pad_smd 5mil, copper clearance wire_polygon to via 5mil, copper clearance pad_smd to pad_smd 5mil, copper clearance pad_smd to via 5mil, copper clearance via to via 5mil, copper clearance smd to pad (same net) 5mil, copper clearance smd to via (same net) 5mil, copper clearance smd to smd (same net) 5mil, dimension clearance 0.2mm, via restrict clearance 0mil, restrict clearance 0mil, drill distance 6mil, keepout clearance 0mil

### Footprints (pad centres in the part's own frame; a part is rotated, then mirrored left to right if it is on the bottom)
2450AT18B100E_ANTC3216X140N = smd 1.15 x 1.8: 1 -1.5,0; 2 1.5,0
NORDIC_NRF_3_RESC0201_L = smd 0.28 x 0.43: 1 -0.255,0; 2 0.255,0
NORDIC_NRF_3_RESC0402_L = smd 0.5 x 0.6: 1 -0.5,0; 2 0.5,0
GRM011R60J152KE01L_2_CAPC0201X13N = smd 0.22 x 0.23: 1 -0.185,0; 2 0.185,0
GRM011R60J152KE01L_1_0201 = smd 0.35 x 0.25: 1 0,0.275; 2 0,-0.275
ESP32_C6_LIBRARY_5_SOD3716X135N = smd 1.15 x 0.8: 1 -1.75,0; 2 1.75,0
ESP32_C6_LIBRARY_3_SOT95P280X145-6N = smd 1.2 x 0.6: 1 -1.25,0.95; 2 -1.25,0; 3 -1.25,-0.95; 4 1.25,-0.95; 5 1.25,0; 6 1.25,0.95
ESP32_C6_LIBRARY_4_ESP32_C6_LIBRARY_4_ESP32_C6_LIBRARY_4_ESP32_C6_LIBRARY_4_ESP32_WROVER_SPARKFUN-DISCRETESEMI_SOT23-3 = smd 0.8 x 0.9: 1 -0.95,-1; 2 0.95,-1; 3 0,1.1
BQ25180YBGR_BGA8C40P2X4_100X155X50 = smd 0.2 x 0.2: A1 -0.2,0.6; A2 0.2,0.6; B1 -0.2,0.2; B2 0.2,0.2; C1 -0.2,-0.2; C2 0.2,-0.2; D1 -0.2,-0.6; D2 0.2,-0.6
DRV2605YZFR_BGA9C50P3X3_144X144X62 = smd 0.25 x 0.25: A1 -0.5,0.5; A2 0,0.5; A3 0.5,0.5; B1 -0.5,0; B2 0,0; B3 0.5,0; C1 -0.5,-0.5; C2 0,-0.5; C3 0.5,-0.5
BMA423_BMA423 = smd 0.3 x 0.35: 1 -0.75,-0.775; 2 -0.25,-0.775; 3 0.25,-0.775; 4 0.75,-0.775; 7 0.75,0.775; 8 0.25,0.775; 9 -0.25,0.775; 10 -0.75,0.775 | smd 0.35 x 0.3: 5 0.775,-0.25; 6 0.775,0.25; 11 -0.775,0.25; 12 -0.775,-0.25
RT6160AWSC_BGA15C40P3X5_140X230X60 = smd 0.216 x 0.216: A1 -0.4,0.8; A2 0,0.8; A3 0.4,0.8; B1 -0.4,0.4; B2 0,0.4; B3 0.4,0.4; C1 -0.4,0; C2 0,0; C3 0.4,0; D1 -0.4,-0.4; D2 0,-0.4; D3 0.4,-0.4; E1 -0.4,-0.8; E2 0,-0.8; E3 0.4,-0.8
503480-2400_5034802400 = smd 0.3 x 0.7: 1 -5.75,1.525; 2 -5.25,1.525; 3 -4.75,1.525; 4 -4.25,1.525; 5 -3.75,1.525; 6 -3.25,1.525; 7 -2.75,1.525; 8 -2.25,1.525; 9 -1.75,1.525; 10 -1.25,1.525; 11 -0.75,1.525; 12 -0.25,1.525; 13 0.25,1.525; 14 0.75,1.525; 15 1.25,1.525; 16 1.75,1.525; 17 2.25,1.525; 18 2.75,1.525; 19 3.25,1.525; 20 3.75,1.525; 21 4.25,1.525; 22 4.75,1.525; 23 5.25,1.525; 24 5.75,1.525 | smd 0.3 x 1: MP1 -6.54,-1.125; MP2 6.54,-1.125
TC2030-IDC_TC2030IDC = smd 0.783 x 0.783: 1 -0.953,-0.635; 2 -0.953,0.635; 3 0.317,-0.635; 4 0.317,0.635; 5 1.588,-0.635; 6 1.588,0.635 | hole 2.451: -2.223,-2.54; -2.223,2.54; 0.952,-2.54; 0.952,2.54 | hole 1.067: -2.223,0; 2.857,-1.016; 2.857,1.016
KH-TYPE-C-16P_KINGHELM_KH-TYPE-C-16P = smd 0.6 x 1.15: A1_B12 -3.2,4.725; A4_B9 -2.4,4.725; A9_B4 2.4,4.725; A12_B1 3.2,4.725 | smd 0.3 x 1.15: A5 -1.25,4.725; A6 -0.25,4.725; A7 0.25,4.725; A8 1.25,4.725; B5 1.75,4.725; B6 0.75,4.725; B7 -0.75,4.725; B8 -1.75,4.725 | drill 0.65 pad 1.05: SH1 -4.32,0; SH2 4.32,0; SH3 -4.32,4.15; SH4 4.32,4.15 | hole 0.7: -2.89,3.65; 2.89,3.65
NORDIC_NRF_2_RESC0402_L = smd 0.5 x 0.6: 1 -0.5,0; 2 0.5,0
ESP32_C6_LIBRARY_2_IND_4828-WE-TPC_WRE = smd 0.9 x 5.3: 1 -2.286,0; 2 2.286,0
MLP2016SR47MT0S1_INDC2016X100N = smd 1.2 x 2.2: 1 -1.028,0; 2 1.028,0
ESP32_C6_LIBRARY_6_SOT65P210X110-3N = smd 1.05 x 0.5: 1 -1.05,0.65; 2 -1.05,-0.65; 3 1.05,0
CPF0201D7K68C1_0201 = smd 0.35 x 0.25: 1 0,0.275; 2 0,-0.275
ESP32_C6_LIBRARY_7_JUMPER_SJ = smd 1.168 x 1.6: 1 -0.762,0; 2 0.762,0
2025-10-22_07-23-44_LIBRARY_SW_EVP-AKE31A_PAN = smd 0.711 x 1.092: 1 -1.4,-0.972; 2 1.4,-0.972 | drill 0.559 pad 0.914 square: 3 -1.848,0.381; 4 1.848,0.381 | smd 1.397 x 1.092: 5 0,-1.124
HECTOR_WATCH_1_TP20R = smd 2 x 2: TP 0,0
NORDIC_NRF_4_AQFN50P700X700X85_HS-74N = smd 4.85 x 4.85: P$74 0,0 | drill 0.3 pad 0.6: P$75 -1.8,1.8; P$76 -0.6,1.8; P$77 0.6,1.8; P$78 1.8,1.8; P$79 -1.8,0.6; P$80 -0.6,0.6; P$81 0.6,0.6; P$82 1.8,0.6; P$83 -1.8,-0.6; P$84 -0.6,-0.6; P$85 0.6,-0.6; P$86 1.8,-0.6; P$87 -1.8,-1.8; P$88 -0.6,-1.8; P$89 0.6,-1.8; P$90 1.8,-1.8 | smd 0.2 x 0.2: P$A8 -1.25,3.25; P$A10 -0.75,3.25; P$A12 -0.25,3.25; P$A14 0.25,3.25; P$A16 0.75,3.25; P$A18 1.25,3.25; P$A20 1.75,3.25; P$A22 2.25,3.25; P$A23 2.75,3.25; P$AA24 3.25,-2.25; P$AB2 -2.75,-2.5; P$AC5 -2,-2.75; P$AC9 -1,-2.75; P$AC11 -0.5,-2.75; P$AC13 0,-2.75; P$AC15 0.5,-2.75; P$AC17 1,-2.75; P$AC19 1.5,-2.75; P$AC21 2,-2.75; P$AC24 3.25,-2.75; P$AD2 -2.75,-3.25; P$AD4 -2.25,-3.25; P$AD6 -1.75,-3.25; P$AD8 -1.25,-3.25; P$AD10 -0.75,-3.25; P$AD12 -0.25,-3.25; P$AD14 0.25,-3.25; P$AD16 0.75,-3.25; P$AD18 1.25,-3.25; P$AD20 1.75,-3.25; P$AD22 2.25,-3.25; P$AD23 2.75,-3.25; P$B1 -3.25,2.75; P$B3 -2.5,2.75; P$B5 -2,2.75; P$B7 -1.5,2.75; P$B9 -1,2.75; P$B11 -0.5,2.75; P$B13 0,2.75; P$B15 0.5,2.75; P$B17 1,2.75; P$B19 1.5,2.75; P$B24 3.25,2.75; P$C1 -3.25,2.25; P$D2 -2.75,2; P$D23 2.75,2; P$E24 3.25,1.75; P$F2 -2.75,1.5; P$F23 2.75,1.5; P$G1 -3.25,1.25; P$H2 -2.75,1; P$H23 2.75,1; P$J1 -3.25,0.75; P$J24 3.25,0.75; P$K2 -2.75,0.5; P$L1 -3.25,0.25; P$L24 3.25,0.25; P$M2 -2.75,0; P$N1 -3.25,-0.25; P$N24 3.25,-0.25; P$P2 -2.75,-0.5; P$P23 2.75,-0.5; P$R1 -3.25,-0.75; P$R24 3.25,-0.75; P$T2 -2.75,-1; P$T23 2.75,-1; P$U1 -3.25,-1.25; P$U24 3.25,-1.25; P$V23 2.75,-1.5; P$W1 -3.25,-1.75; P$W24 3.25,-1.75; P$Y2 -2.75,-2; P$Y23 2.75,-2
ESP32_C6_LIBRARY_SON50P200X200X80-9N = smd 0.76 x 0.27: 1 -0.985,0.75; 2 -0.985,0.25; 3 -0.985,-0.25; 4 -0.985,-0.75; 5 0.985,-0.75; 6 0.985,-0.25; 7 0.985,0.25; 8 0.985,0.75 | smd 0.9 x 1.3: 9 0,0
NORDIC_NRF_BT-XTAL_2016_N = smd 0.95 x 0.85: 1 -0.725,-0.575; 2 0.725,-0.575; 3 0.725,0.575; 4 -0.725,0.575
NORDIC_NRF_1_XTAL_3215_N = smd 1 x 1.8: 1 -1.25,0; 2 1.25,0

### Placement (x,y rotation side)
ANT1  43.47,17.13 0 top
C1  38.55,18.4 0 top
C1-EP-DR  19.86,24.9 270 top
C2  39.27,19.9 0 top
C2-EP-DR  9.08,32.9 270 top
C3  34.87,14.9 270 top
C4  37.93,15.03 270 top
C5  24.28,17.9 90 top
C6  24.86,11.9 180 top
C7  30.17,9.4 270 top
C8  34.48,10.4 0 top
C9  34.52,13.4 0 top
C10  37.67,21.77 0 top
C11  35.48,21.9 0 top
C12  32.79,18.4 90 top
C13  32.6,19.9 90 top
C14  25.91,18.4 90 top
C15  28.72,20.4 0 top
C16  30.8,20.4 0 top
C17  24.84,15.9 0 top
C18  24.65,14.9 0 top
C19  18.46,10.4 0 top
C20  25.16,9.9 90 top
C21  26.97,8.9 270 top
C22  39.28,14.9 270 top
C23  2.09,7.4 90 top
C24  1.03,7.9 90 top
C25  5.98,2.4 90 top
C27  29.25,2.67 0 top
C29  10.56,5.17 90 top
C30  32.41,5.17 0 top
C31  21.45,5.32 0 top
C32  17.99,8.17 0 top
C33  7.57,2.4 90 top
C34  37.61,12.17 0 top
C37  30.69,3.4 180 top
C38  30.5,5.9 180 top
C39  30.81,4.9 0 top
C42  28.22,2.67 0 top
C43  35.97,5.9 0 top
D2  4.87,29.13 180 top
D3  22.03,24.98 270 top
D4  5.34,31.63 0 top
D5  4.65,27 0 top
DMG2305UX-7  44.17,10.13 270 top
EPD_C1  12.5,20.9 180 top
EPD_C2  12.65,22.05 180 top
EPD_C5  12.96,18.55 180 top
EPD_C6  13.54,17.32 180 top
EPD_C7  13.85,16.05 180 top
EPD_C8  13.43,15.05 180 top
EPD_C9  13.13,13.87 180 top
EPD_C10  13.45,12.55 180 top
EPD_C11  13.26,11.55 180 top
EPD_C12  11.84,10.05 180 top
IC1  28.05,5.05 0 top
IC2  17.67,5.78 0 top
IC3  18.25,13.55 0 top
IC9  4.6,6.55 0 top
J1  8.9,17.59 270 top
J2  38.44,28.13 180 top
J4  24.43,34.1 180 top
L1  36.42,15.55 0 top
L2  27,18.55 90 top
L3  26.81,20.55 90 top
L5  15.24,26.24 270 top
L7  9.63,7.55 90 top
Q3  12.48,32.55 90 top
R1_ED_DR  13.37,30.32 270 top
R1_USB  25.68,27.82 180 top
R2  7.22,5.32 270 top
R2_EP_DR  11.26,30.32 90 top
R2_USB  22.8,27.82 0 top
R3  13.61,5.82 0 top
R4  6.81,6.32 270 top
R5  28.56,9.54 0 top
R7  34.13,12.32 90 top
R8  29.04,9.82 0 top
R9  32.08,7.82 0 top
R17  6.79,3.82 270 top
R18  8.33,4.82 90 top
R_PWR_EPD  32.12,9.82 0 top
R_TYPE_SEL  17.93,32.86 180 top
SJ1  16.36,32.06 90 top
SW_DN  12.17,2.99 180 top
SW_ENT  23.16,2.99 180 top
SW_UP  33.92,2.99 180 top
TP_3.3V  36.18,33.72 0 top
TP_3V3  39.86,33.59 0 top
TP_BAT_GND  38.36,4.34 0 top
TP_GND  38.9,1.3 0 top
TP_ON  16.61,1.28 0 top
TP_OP  19.02,1.34 0 top
TP_RESET  32.15,33.72 0 top
TP_SCL  3.24,2.75 0 top
TP_SDA  13.72,8.78 0 top
TP_SWDCLK  44.3,29.34 0 top
TP_SWDIO  44.61,25.84 0 top
TP_SWO  34.19,7.84 0 top
TP_VBAT  38.27,7.84 0 top
TP_VREG  22.16,10.71 0 top
U1  29.89,13.8 0 top
U3  42.28,4.84 0 top
X1  36.25,19.18 90 top
X2  21.21,17.84 270 top

### Tracks (layer width: path | path; a pad name or v marks a point on that pad's centre or on a via)
3V3  (via drill 0.3)  (1 unrouted)
  Top 0.3: U1.P$B1 26.62,16.56 25.93,17.25 25.93,17.87 C14.1 25.79,17.94 25.31,17.94 23.37,19.88 23.09,19.88 | 18.25,15.52 17.83,15.52 17.48,15.17 17.48,14.34 IC3.10 | 18.25,15.52 18.94,14.83 18.94,14.34 IC3.7 19.15,14.34 19.28,14.34 v19.56,14.06 | 23.09,19.88 19.77,19.88 18.31,18.43 18.31,15.66 18.25,15.52 | 6.96,1.94 7.51,1.94 C33.1 | 6.96,1.94 5.99,1.94 C25.1 | IC9.E3 5.02,5.75 6.68,5.75 6.75,5.82 7.72,5.82 8.07,5.48 8.07,4.85 R18.1 8.07,4.71 8.07,4.58 7.96,4.47 | 7.96,4.47 7.37,3.88 7.1,3.88 R17.1 6.96,3.74 6.96,1.94 | 26.69,11.99 26.83,11.85 27.11,11.85 U1.P$Y2 | 26.69,11.99 U1.P$W1 | 26.69,11.99 26.55,11.92 25.38,11.92 C6.1 25.24,11.99 24.69,12.54 19.49,12.54 19.21,12.26 18.45,12.26 | 16.17,5.34 16.65,4.85 17.34,4.85 17.62,5.13 17.62,5.27 IC2.C2 | 16.17,5.34 16.17,8.38 18.18,10.39 C19.1 18.25,10.53 18.25,10.74 18.45,10.95 18.45,12.26 | 18.45,12.26 18.45,12.75 IC3.3 | v8.2,4.23 7.96,4.47 | v12.7,6.03 12.7,5.75 13.33,5.13 15.89,5.13 16.03,5.27 16.17,5.34 | TP_3.3V.TP 39.78,33.73 TP_3V3.TP 39.92,33.66 42.27,31.31 42.27,29.99 41.38,29.09 40.34,29.09 40.06,28.81 39.44,28.81 J2.1 39.3,28.68 39.3,28.47 v38.88,28.05 | 34.69,12.02 34.45,12.26 R7.2 | 34.69,12.02 34.8,11.92 37.57,11.92 C34.2 | R5.2 28.56,9.29 28.77,9.29 28.98,9.49 R8.2 29.12,9.63 30.16,9.63 C7.1 30.3,9.63 30.57,9.63 v30.78,9.42 | C12.1 32.79,18.08 32.16,17.46 32.16,17.11 U1.P$A22 32.16,16.9 32.51,16.56 v32.65,16.56 | 32.65,9.91 32.65,10.53 U1.P$AD23 | 32.65,9.91 32.3,9.56 32.16,9.56 R_PWR_EPD.2 | v34.24,9.77 34.24,10.39 C8.1 | v32.86,9.77 32.79,9.84 32.65,9.91 | v41.51,9.22 43.11,9.22 DMG2305UX-7.2 | v34.94,12.26 34.69,12.02
  Top 0.3: v23.09,20.5 23.09,19.88
  Bottom 0.3: v8.2,4.23 9.38,4.23 11.18,6.03 v12.7,6.03 12.77,6.17 19.56,12.95 v19.56,14.06 | 33.76,9.77 v32.86,9.77 32.72,9.84 32.1,10.46 31.33,10.46 30.78,9.91 v30.78,9.42 | 33.76,9.77 v34.24,9.77 34.38,9.7 34.87,9.22 v41.51,9.22 | 34.38,12.26 34.38,11.85 33.76,11.22 33.76,9.77 | 34.38,12.26 34.38,13.44 33,14.83 33,16.21 v32.65,16.56 32.58,16.69 32.37,16.9 32.37,24.17 | 34.38,12.26 v34.94,12.26 | v38.88,28.05 35.21,28.05 32.37,25.21 32.37,24.17 | v23.09,20.5 23.09,23.62 23.65,24.17 32.37,24.17
ALERT  (via drill 0.3)
  Top 0.15: v42.55,6.52 40.06,9.01 40.06,10.6 37.84,12.82 36.04,12.82 34.31,14.55 33.2,14.55 U1.P$J24 | v44.01,4.44 43.66,4.09 43.31,4.09 U3.5
  Bottom 0.15: v42.55,6.52 43.18,6.52 44.49,5.2 44.49,4.92 v44.01,4.44
D+  (via drill 0.3)
  Top 0.15: v25.93,9.56 26.55,8.94 27.39,8.94 27.52,9.08 27.52,9.29 28.15,9.91 28.15,10.53 U1.P$AD6 | v21.15,14.48 19.77,15.86 v19.77,19.12 | v20.39,23.06 21.01,23.69 D3.4
  Bottom 0.15: v25.93,9.56 25.93,10.05 21.5,14.48 v21.15,14.48 | v19.77,19.12 19.77,22.44 v20.39,23.06
D-  (via drill 0.3)
  Top 0.15: v27.66,10.05 27.66,10.53 U1.P$AD4 | v23.65,23.41 23.3,23.41 23.02,23.69 D3.6
  Bottom 0.15: v27.66,10.05 30.36,10.05 31.68,11.36 31.96,11.36 32.3,11.71 32.3,15.86 24.75,23.41 v23.65,23.41
DN
  Top 0.15: 24.48,28.54 24.2,28.81 24.2,29.37 J4.A7 | 24.48,28.54 24.89,28.54 25.17,28.81 25.17,29.37 J4.B7 | 24.48,28.54 24.48,28.19 23.02,26.74 23.02,26.25 D3.1
DP
  Top 0.15: J4.A6 24.62,29.44 24.62,29.99 24.41,30.2 23.92,30.2 23.72,29.99 23.72,29.44 J4.B6 23.65,29.37 23.65,27.77 23.02,27.15 21.71,27.15 21.08,26.53 21.08,26.25 D3.3
EPD_3V3  (via drill 0.3)
  Top 0.3: J1.16 10.49,15.86 10.49,16.21 J1.15 10.49,16.35 10.84,16.35 12.43,17.94 12.43,18.49 EPD_C5.2 12.57,18.63 15.61,21.68 23.79,21.68 25.17,23.06 25.59,23.06 25.93,23.41 25.93,24.17 | 19.21,25.35 16.65,25.35 15.27,23.97 L5.2 | 19.21,25.35 19.84,25.35 C1-EP-DR.1 | v44.08,10.19 45.25,10.19 DMG2305UX-7.3 | v32.93,21.33 31.68,21.33 28.84,24.17 25.93,24.17 | 25.93,24.17 25.17,24.17 23.51,22.51 20.18,22.51 19.21,23.48 19.21,25.35
  Bottom 0.3: v32.93,21.33 v44.08,10.19
EPD_BUSY  (via drill 0.3)
  Top 0.15: v31.06,23.62 37.15,23.62 40.41,20.37 40.41,15.45 40.61,15.24 40.61,9.49 44.77,5.34 44.77,4.16 43.73,3.12 37.84,3.12 36.25,4.71 35.56,4.71 32.93,7.35 32.93,7.9 30.78,10.05 30.16,10.05 29.67,10.53 U1.P$AD12 | v25.38,23.62 25.17,23.62 23.65,22.1 15.06,22.1 12.36,19.4 10.49,19.4 J1.9
  Bottom 0.15: v25.38,23.62 v31.06,23.62
EPD_CS  (1 unrouted)
EPD_DC  (1 unrouted)
EPD_RST  (1 unrouted)
GDR
  Top 0.15: Q3.1 11.8,31.45 11.6,31.24 11.6,30.34 R2_EP_DR.2 11.53,30.27 11.53,23.62 10.77,22.86 10.49,22.86 J1.2
GND  (via drill 0.3)
  Top 0.15: C8.2 34.8,10.39 34.8,8.94 36.46,7.28 36.46,5.96 C43.2 36.53,5.89 38.05,4.37 38.33,4.37 TP_BAT_GND.TP 38.4,4.3 39.71,4.3 | C3.2 34.94,14.69 37.84,14.69 37.91,14.76 C4.2 37.91,14.69 39.23,14.69 C22.2 39.3,14.62 39.3,11.78 40.34,10.74 40.34,9.35 44.49,5.2 44.49,4.3 43.94,3.74 42.83,3.74 42.62,3.95 42.62,4.58 U3.9 | C9.2 34.8,13.37 35.7,12.47 37.57,12.47 C34.1 37.63,12.4 37.77,12.26 37.84,12.26 39.78,10.32 39.78,7.07 41.24,5.61 U3.1 41.31,5.55 41.65,5.55 42.34,4.85 U3.9 | U3.9 42.27,4.78 41.58,4.09 U3.4 41.24,4.09 40.96,4.09 40.75,4.3 39.71,4.3 | U3.6 43.24,4.65 42.48,4.65 42.34,4.78 U3.9 | 17.83,8.59 17.14,8.59 16.79,8.25 16.79,6.17 17.14,5.82 IC2.B1 | 17.83,8.59 17.97,8.45 C32.1 18.04,8.38 18.66,8.38 21.43,5.61 C31.1 21.5,5.55 22.4,5.55 | C19.2 18.66,10.39 18.66,9.49 17.83,8.66 17.83,8.59 | 23.3,5.55 22.4,5.55 | 23.3,5.55 24.55,4.3 24.55,4.02 SW_ENT.1 24.62,3.95 26.62,3.95 28.22,2.36 C42.2 28.29,2.43 28.63,2.43 29.19,2.98 C27.1 29.26,2.98 30.64,2.98 30.85,3.19 30.85,3.33 C37.1 30.92,3.47 30.92,4.23 31.27,4.58 31.27,4.85 C39.2 31.33,4.92 31.82,5.41 32.37,5.41 C30.1 | C6.2 24.41,11.85 25.1,11.15 25.1,10.46 C20.2 25.1,10.39 24.62,9.91 24.62,9.08 25.24,8.45 | 25.24,8.45 26.9,8.45 C21.2 | 23.3,5.55 23.3,6.45 25.24,8.38 25.24,8.45 | 31.61,7.69 32.03,8.11 R9.1 32.1,8.04 32.23,8.04 32.51,7.76 32.51,5.48 C30.1 | 31.61,7.69 30.71,6.79 30.71,5.96 C38.1 | 31.61,7.69 30.23,9.08 C7.2 | C30.1 32.44,5.41 34.17,5.41 35.28,4.3 35.28,4.02 SW_UP.1 35.35,3.95 35.83,3.95 37.74,2.05 | 37.74,2.05 38.47,1.32 38.88,1.32 TP_GND.TP | v39.71,4.02 39.71,4.3 | 37.74,2.05 v38.19,2.5
  Top 0.15: 18.52,5.41 18.18,5.75 IC2.B3 | 18.52,5.41 18.52,5.13 17.41,4.02 13.61,4.02 SW_DN.1 13.74,4.09 12.22,5.61 12.22,6.17 12.57,6.52 12.84,6.52 13.26,6.1 R3.1 | v29.05,4.71 28.84,4.51 28.29,4.51 IC1.D2 | v18.73,5.41 18.52,5.41 | C18.1 24.34,14.96 21.08,14.96 20.05,16 20.05,17.18 20.18,17.32 v22.4,17.32 23.16,17.32 24.55,15.93 C17.1 | IC3.8 18.45,14.34 18.04,14.34 IC3.9 18.04,14.41 v18.04,14.96 | v25.38,17.32 24.55,18.15 24.34,18.15 C5.2 | 38.81,19.05 38.81,18.43 C1.2 | 38.81,19.05 39.5,19.74 39.5,19.88 C2.2 39.5,19.95 39.5,20.09 37.98,21.61 37.98,21.75 C10.2 37.91,21.61 37.63,21.33 37.15,21.33 36.39,22.1 36.39,22.3 36.04,22.65 34.87,22.65 32.48,20.26 | C11.2 35.7,21.89 35.7,21.13 35,20.43 35,19.12 35.63,18.49 X1.4 35.63,18.56 36.8,19.74 36.8,19.88 X1.2 36.87,19.74 37.57,19.05 38.81,19.05 | 32.48,20.26 32.58,20.16 C13.2 32.65,20.09 32.86,20.09 33.06,19.88 33.06,19.47 32.86,19.26 32.86,18.7 C12.2 | 32.48,20.26 32.37,20.37 31.06,20.37 C16.2 31.13,20.3 30.78,19.95 30.3,19.95 29.88,20.37 29.26,20.37 C15.2 29.26,20.3 29.26,18.15 28.29,17.18 28.29,16.49 28.36,16.49 | U1.P$F23 32.58,15.31 32.03,15.31 31.75,15.59 U1.P$74 | 28.36,16.49 28.36,15.86 28.15,15.66 U1.P$74 | 28.36,16.49 U1.P$B7 | C14.2 25.93,18.84 26.49,18.29 26.49,17.25 27.04,16.69 27.04,16.42 27.25,16.21 28.29,16.21 U1.P$74 | U1.P$74 28.08,14.34 28.08,13.23 U1.P$83 28.08,13.16 28.08,12.05 U1.P$87 | U1.P$79 28.08,14.41 U1.P$74 | U1.P$84 29.33,13.23 29.33,13.93 U1.P$74 | U1.P$80 29.33,14.41 U1.P$74 | U1.P$74 30.5,13.16 30.5,12.05 U1.P$89 30.57,12.05 31.68,12.05 U1.P$90 31.68,12.12 31.68,13.16 U1.P$86
  Top 0.15: U1.P$85 30.5,13.23 U1.P$74 | U1.P$81 30.5,14.41 U1.P$74 | 31.13,14.96 U1.P$82 | U1.P$76 29.26,15.59 28.77,15.59 U1.P$74 | 31.13,14.96 30.5,15.59 U1.P$77 | 31.13,14.96 U1.P$74 | U1.P$78 31.75,15.66 U1.P$74 | U1.P$75 28.08,15.66 U1.P$74 | v22.4,5.48 22.4,5.55 | C29.1 10.28,5.13 9.8,5.13 7.58,2.91 C33.2 7.58,2.84 8.13,2.29 8.13,1.6 7.93,1.39 5.64,1.39 5.43,1.6 5.43,2.36 5.92,2.84 C25.2 5.92,2.91 5.71,3.12 5.64,3.12 3.56,5.2 3.56,5.89 | 4.26,6.58 4.53,6.58 IC9.C2 4.6,6.58 4.95,6.58 IC9.C3 | 4.26,6.58 IC9.C1 4.19,6.65 3.56,6.03 3.56,5.89 | 4.26,6.58 4.26,6.93 IC9.B1 | 3.56,5.89 3.49,5.89 2.25,7.14 2.04,7.14 C23.1 2.04,7.21 1.21,7.21 1.07,7.35 C24.1 1,7.41 1,7.55 0.52,8.04 0.52,8.73 1.97,10.19 7.1,10.19 7.86,10.95 J1.MP2 | 14.3,15.45 14.3,16 EPD_C7.1 14.3,16.07 14.09,16.28 14.09,17.32 EPD_C6.1 14.02,17.39 13.47,17.94 13.47,18.49 EPD_C5.1 | 14.3,15.45 13.95,15.1 EPD_C8.1 13.88,15.03 13.67,14.83 13.67,13.93 EPD_C9.1 13.67,13.86 13.67,12.82 13.88,12.61 EPD_C10.1 13.88,12.54 13.88,11.64 13.81,11.57 EPD_C11.1 13.74,11.5 12.36,10.12 EPD_C12.1 12.29,10.05 11.74,9.49 11.04,9.49 9.52,11.02 7.79,11.02 J1.MP2 | J1.MP2 7.79,11.09 7.79,24.1 J1.MP1 7.72,24.17 7.37,24.52 7.37,24.59 7.16,24.8 3.84,24.8 2.11,26.53 2.11,30.13 3.56,31.58 D4.1 3.63,31.65 5.85,31.65 8.55,34.35 19.84,34.35 20.05,34.15 J4.SH2 20.11,34.08 20.11,32.07 | SJ1.1 16.38,31.31 16.65,31.31 17.9,32.55 R_TYPE_SEL.1 17.97,32.55 18.31,32.9 18.31,33.38 18.04,33.66 15.48,33.66 14.64,32.83 12.08,32.83 11.04,31.79 11.04,30.34 R2_EP_DR.1 10.97,30.27 10.97,24.73 9.87,23.62 9.87,20.09 10.07,19.88 10.07,19.81
  Top 0.15: 10.07,19.81 9.87,19.6 9.87,15.59 10.07,15.38 10.42,15.38 J1.17 | 10.07,19.81 10.42,19.81 J1.8 10.49,19.88 11.88,19.88 12.84,20.85 12.98,20.85 EPD_C1.1 13.05,20.92 13.05,21.96 13.12,22.03 EPD_C2.1 13.12,22.1 13.12,22.58 12.36,23.34 12.36,25.63 12.64,25.9 20.53,25.9 | 21.95,28.29 21.29,28.95 21.29,29.37 J4.A12_B1 21.15,29.37 20.67,29.37 20.11,29.92 J4.SH4 20.11,29.99 20.11,32.07 | 21.95,28.29 22.54,27.71 22.61,27.71 22.75,27.57 R2_USB.2 | R1_USB.1 25.66,27.5 25.45,27.5 23.37,25.42 22.54,25.42 22.05,25.9 22.05,26.18 D3.2 21.98,25.9 21.05,24.97 | 21.05,24.97 20.53,24.45 19.91,24.45 C1-EP-DR.2 | 21.95,28.29 20.53,26.87 20.53,25.9 | 20.53,25.9 20.53,25.49 21.05,24.97 | J2.3 38.12,28.81 36.87,28.81 J2.5 36.87,28.88 36.87,29.02 35.9,29.99 28.77,29.99 J4.SH3 | J4.A1_B12 27.66,29.44 28.22,29.44 28.7,29.92 J4.SH3 | 28.77,32.07 28.77,30.06 J4.SH3 | 28.77,32.07 28.77,34.08 J4.SH1 | 28.77,32.07 20.11,32.07 | v14.85,14.96 14.37,15.45 14.3,15.45
  Bottom 0.15: v38.19,2.5 v39.71,4.02 | U1.P$87 28.15,11.99 29.19,11.99 U1.P$88 29.26,11.99 29.26,11.29 28.49,10.53 26.9,10.53 26.55,10.19 26.55,9.84 29.26,7.14 29.26,5.27 29.05,5.06 v29.05,4.71 28.98,4.92 28.63,4.92 28.15,5.41 22.4,5.41 | 22.4,5.41 v18.73,5.41 | U1.P$75 28.08,15.66 26.42,17.32 v25.38,17.32 v22.4,17.32 20.6,17.32 18.25,14.96 v18.04,14.96 v14.85,14.96 | v22.4,5.48 22.4,5.41
  pour Top: -3.34,38.21 -3.34,-1.79 51.66,-1.79 51.66,38.21
  pour Bottom: -2.84,37.71 -2.84,-1.29 51.16,-1.29 51.16,37.71
HAPTIC_EN  (via drill 0.3)
  Top 0.15: v22.26,13.09 24.69,13.09 25.17,12.61 26.62,12.61 U1.P$U1 | v19.21,10.05 v20.81,11.64 | v17.28,8.11 17.28,6.38 17.21,6.31 IC2.A1
  Bottom 0.15: v20.81,11.64 v22.26,13.09 | v17.28,8.11 v19.21,10.05
IMU_INT1
  Top 0.15: U1.P$N1 26.62,13.58 19.42,13.58 19.08,13.23 IC3.5
IMU_INT2  (1 unrouted)
LX1  (1 unrouted)
  Top 0.15: IC9.B2 4.6,6.93 4.95,6.93 IC9.B3
LX2
  Top 0.15: IC9.D2 4.6,6.17 4.95,6.17 IC9.D3 5.02,6.17 5.23,6.17 7.58,8.52 9.59,8.52 L7.2
MOSI  (1 unrouted)
N$1  (via drill 0.3)
  Top 0.15: v6.47,4.85 4.6,4.85 3.84,5.61 3.84,5.89 4.05,6.1 4.19,6.1 IC9.D1 | v5.99,6.31 6.47,6.31 R4.2
  Bottom 0.15: v6.47,4.85 6.47,5.82 v5.99,6.31
N$2
  Top 0.15: IC9.E1 4.26,5.68 4.26,5.61 4.53,5.34 6.89,5.34 R2.2
N$3
  Top 0.15: R3.2 13.67,5.55 14.23,5.55 15.75,7.07 15.75,11.02 17.48,12.75 IC3.1
N$4
  Top 0.15: IC1.D1 27.87,4.44 27.87,4.37 28.15,4.09 30.36,4.09 30.85,4.58 30.85,5.55 32.03,6.72 32.03,7.48 R9.2
N$5
  Top 0.15: U1.P$N24 33.2,13.51 34.17,13.51 34.24,13.44 C9.1
N$6  (1 unrouted)
  Top 0.15: L1.2 36.94,15.52 37.15,15.31 37.91,15.31 C4.1 37.98,15.24 38.05,15.17 39.23,15.17 C22.1
N$7
  Top 0.15: U1.P$H23 32.65,14.83 32.93,14.83 33.2,15.1 34.87,15.1 C3.1 34.94,15.17 35.07,15.17 35.42,15.52 35.9,15.52 L1.1
N$8
  Top 0.15: U1.P$B24 33.2,16.56 35,16.56 36.87,18.43 X1.1 36.94,18.43 38.26,18.43 C1.1
N$9
  Top 0.15: 36.11,20.64 36.11,20.37 35.7,19.95 X1.3 | 36.11,20.64 36.11,22.16 35.9,22.37 35,22.37 34.45,21.82 34.45,19.12 32.65,17.32 32.65,17.11 U1.P$A23 | 36.11,20.64 37.29,20.64 37.98,19.95 38.95,19.95 C2.1
N$10  (via drill 0.3)
  Top 0.15: v33.55,16.07 33.27,16.07 33.06,15.86 32.65,15.86 U1.P$D23 | v33.55,17.59 33.55,17.8 34.73,18.98 34.73,21.4 35.21,21.89 C11.1
  Bottom 0.15: v33.55,17.59 v33.55,16.07
N$11
  Top 0.15: U1.P$A18 31.19,17.11 31.19,18.22 32.58,19.6 C13.1
N$12
  Top 0.15: L3.1 26.83,20.02 26.83,19.26 26.97,19.12 L2.2
N$13
  Top 0.15: U1.P$B3 27.39,17.66 27.04,18.01 L2.1
N$14  (via drill 0.3)
  Top 0.15: 27.94,20.09 27.94,16.56 U1.P$B5 | 27.94,20.09 28.22,20.37 C15.1 28.29,20.43 28.77,20.92 29.74,20.92 30.23,20.43 30.5,20.43 C16.1 30.5,20.5 v31.13,21.13 | L3.2 26.83,20.99 26.97,20.99 27.87,20.09 27.94,20.09 | U1.P$E24 33.2,15.59 35.07,15.59 37.22,17.73 38.81,17.73 39.92,18.84 39.92,20.43 38.12,22.23 37.7,22.23 37.43,21.96 37.43,21.82 C10.1 37.36,21.96 36.39,22.93 34.73,22.93 33.76,21.96 v31.82,21.96
  Bottom 0.15: v31.13,21.13 31.13,21.27 v31.82,21.96
N$15
  Top 0.15: U1.P$D2 27.11,15.79 26.83,15.79 26.76,15.73 25.24,15.73 25.1,15.86 C17.2 25.03,15.93 25.03,16.14 22.12,19.05 21.22,19.05 X2.1
N$16
  Top 0.15: U1.P$C1 26.62,16.07 25.86,16.07 24.34,17.59 C5.1
N$17
  Top 0.15: U1.P$F2 27.11,15.31 26.83,15.31 26.76,15.38 25.38,15.38 24.96,14.96 C18.2 24.96,15.03 24.55,15.45 22.33,15.45 21.22,16.56 X2.2
N$18
  Top 0.15: U1.P$AC5 27.87,11.02 27.32,11.02 27.25,10.95 26.69,10.95 25.17,9.42 C20.1
N$19
  Top 0.15: D5.2 6.4,27.01 6.4,27.64 9.03,30.27 9.03,32.35 C2-EP-DR.2 9.1,32.41 11.25,32.41 12.43,33.59 Q3.3 12.5,33.66 12.77,33.94 18.18,33.94 18.59,33.52 18.59,31.86 15.27,28.54 L5.1
N$20
  Top 0.15: C2-EP-DR.1 9.03,33.38 8.83,33.38 7.1,31.65 D4.2 7.03,31.58 6.68,31.24 6.68,29.16 D2.1
N$21
  Top 0.15: R1_ED_DR.1 13.67,30.34 16.1,32.76 16.31,32.76 SJ1.2 16.38,32.9 16.58,33.11 17.9,33.11 R_TYPE_SEL.2
N$22
  Top 0.15: EPD_C2.2 12.08,22.03 10.9,22.03 10.77,21.89 10.49,21.89 J1.4
N$23
  Top 0.15: EPD_C1.2 11.94,20.92 11.18,20.92 10.77,21.33 10.49,21.33 J1.5
N$24
  Top 0.15: IC2.A2 17.69,6.31 17.69,7.55 17.97,7.83 C32.2
N$25
  Top 0.15: R1_USB.2 25.66,28.12 25.66,29.37 J4.A5
N$26
  Top 0.15: EPD_C6.2 12.98,17.32 12.98,17.11 10.77,14.89 10.49,14.89 J1.18
N$27
  Top 0.15: J1.19 10.77,14.34 12.43,16 13.33,16 EPD_C7.2
N$28
  Top 0.15: EPD_C10.2 12.91,12.61 10.97,12.61 10.77,12.82 10.49,12.82 J1.22
N$29
  Top 0.15: EPD_C8.2 12.91,15.03 11.94,15.03 10.77,13.86 10.49,13.86 J1.20
N$30
  Top 0.15: R2_USB.1 22.75,28.12 22.75,29.37 J4.B5
N$32
  Top 0.15: EPD_C12.2 11.32,10.12 11.32,10.95 10.49,11.78 J1.24
OUT+
  Top 0.15: IC2.A3 18.18,6.24 18.52,6.24 19.21,5.55 19.21,1.53 19.08,1.39 TP_OP.TP
P0.13  (via drill 0.3)
  Top 0.15: U1.P$AD8 28.63,10.53 28.63,9.91 28.56,9.84 R5.1 28.49,9.77 28.36,9.63 28.29,9.63 27.8,9.15 27.8,8.38 26.28,6.86 25.38,6.86 25.03,6.52 25.03,5.55 v26.14,4.44 | C30.2 32.44,4.85 32.44,4.09 32.51,4.02 SW_UP.2 32.37,4.09 32.16,4.09 31.33,3.26 31.33,3.19 30.09,1.94 v28.63,1.94
  Bottom 0.15: v28.63,1.94 v26.14,4.44
P0.14  (via drill 0.3)  (1 unrouted)
  Top 0.15: v28.36,11.02 28.84,11.02 U1.P$AC9 | v21.01,3.54 21.29,3.54 21.71,3.95 SW_ENT.2 21.71,4.02 21.5,4.23 21.5,4.99 C31.2
  Bottom 0.15: v28.36,11.02 25.38,11.02 21.43,14.96 18.66,14.96 11.67,7.97 5.78,7.97 5.02,7.21 5.02,4.99 6.75,3.26 9.59,3.26 9.87,3.54 v21.01,3.54
P1.01  (via drill 0.3)  (1 unrouted)
  Top 0.15: v31.54,9.91 31.68,10.05 32.1,10.05 R_PWR_EPD.1 | v43.11,10.19 43.11,11.02 DMG2305UX-7.1
  Bottom 0.15: v31.54,9.91 32.1,9.91 33.27,8.73 41.65,8.73 v43.11,10.19
P1.02  (via drill 0.3)
  Top 0.15: U1.P$W24 33.2,12.05 33.62,12.05 33.83,12.26 R7.1 33.83,12.33 v33.83,12.95 | SW_DN.2 10.84,4.02 10.84,5.13 C29.2 10.9,5.2 10.97,5.27 10.97,7.76 15.34,12.12 15.34,16 20.32,20.99 23.65,20.99 24.2,21.54 27.25,21.54 v27.52,21.27
  Bottom 0.15: v33.83,12.95 33.83,13.44 32.58,14.69 32.58,16 27.52,21.06 v27.52,21.27
PMIC_INT  (1 unrouted)
PREVGH
  Top 0.15: EPD_C9.2 12.57,13.86 11.25,13.86 10.77,13.37 10.49,13.37 J1.21 10.42,13.37 10.07,13.37 9.59,13.86 9.59,23.27 7.79,25.07 7.03,25.07 5.16,26.94 2.94,26.94 D5.1
PREVGL  (via drill 0.3)
  Top 0.15: EPD_C11.2 12.7,11.57 11.53,11.57 10.77,12.33 10.49,12.33 J1.23 10.35,12.33 10.14,12.33 9.1,13.37 v9.1,23.13 | v4.81,27.43 3.15,29.09 D2.2
  Bottom 0.15: v9.1,23.13 v4.81,27.43
RESE
  Top 0.15: Q3.2 13.12,31.45 13.12,30.34 R1_ED_DR.2 13.05,30.27 12.08,29.3 12.08,23.69 10.77,22.37 10.49,22.37 J1.3
RESET  (1 unrouted)
  Top 0.15: J2.6 36.87,27.5 37.22,27.5 37.84,28.12 38.33,28.12 38.74,28.54 38.74,29.78 39.02,30.06 39.02,31.31 37.84,32.48 33.34,32.48 32.16,33.66 TP_RESET.TP
SCK  (via drill 0.3)
  Top 0.15: v29.26,17.53 29.26,17.46 29.6,17.11 U1.P$A12 | v11.18,17.8 10.77,17.39 10.49,17.39 J1.13
  Bottom 0.15: v29.26,17.53 26.62,17.53 26.35,17.8 v11.18,17.8
SCL  (via drill 0.3)  (1 unrouted)
  Top 0.15: v6.96,4.51 6.54,4.09 6.54,3.88 R17.2 6.47,3.81 6.26,3.61 v5.78,3.61 | v7.58,6.38 7.1,6.38 R4.1 | v25.52,6.38 26.14,6.38 27.25,5.27 27.8,5.27 IC1.B1 | v16.72,5.55 16.93,5.55 17.14,5.34 IC2.C1 | v15.27,7.21 15.27,7.48 | 15.27,7.48 15.27,11.15 17.34,13.23 17.41,13.23 IC3.12 | v44.01,5.06 43.31,5.06 U3.7 | 15.27,7.48 v11.46,7.48 | v4.95,2.77 3.29,2.77 TP_SCL.TP
  Bottom 0.15: v6.96,4.51 6.96,5.75 v7.58,6.38 10.35,6.38 v11.46,7.48 | 18.25,6.38 17.55,6.38 v16.72,5.55 16.79,5.68 v15.27,7.21 | 18.25,6.38 v25.52,6.38 | v44.01,5.06 40.75,5.06 40.2,4.51 32.58,4.51 30.43,2.36 30.43,2.29 30.09,1.94 29.26,1.94 26.28,4.92 18.59,4.92 18.25,5.27 18.25,6.38 | v5.78,3.61 v4.95,2.77
SDA  (via drill 0.3)  (1 unrouted)
  Top 0.15: v27.39,4.78 27.8,4.78 IC1.C1 | v42.55,5.89 42.97,5.89 43.24,5.61 U3.8 | v20.18,14.06 20.25,13.99 26.62,13.99 U1.P$L1 | v18.25,13.37 18.25,13.16 18.04,12.95 18.04,12.82 IC3.2 | v7.51,4.78 7.51,5.27 R2.1 | v9.1,5.06 8.9,4.85 8.62,4.85 R18.2 | v14.51,9.91 13.74,9.15 13.74,8.8 TP_SDA.TP | v28.22,6.72 v29.74,6.72
  Bottom 0.15: v27.39,4.78 28.36,4.78 28.91,4.23 29.74,4.23 | 29.74,4.23 31.19,4.23 32.86,5.89 v42.55,5.89 | 9.1,4.78 9.38,4.78 v14.51,9.91 17.97,13.37 v18.25,13.37 19.42,14.55 19.7,14.55 v20.18,14.06 20.18,11.64 20.67,11.15 23.65,11.15 28.08,6.72 v28.22,6.72 | 9.1,4.78 v7.51,4.78 | 9.1,4.78 v9.1,5.06 | v29.74,6.72 29.74,4.23
SWDCLK  (via drill 0.3)
  Top 0.15: v36.87,7.55 36.87,9.08 34.45,11.5 33.2,11.5 U1.P$AA24 | v39.02,26.6 38.19,27.43 J2.4 | v42.14,27.15 44.28,29.3 TP_SWDCLK.TP
  Bottom 0.15: v36.87,7.55 42.76,7.55 45.05,9.84 45.05,10.81 39.02,16.83 v39.02,26.6 39.09,26.6 39.64,27.15 v42.14,27.15
SWDIO  (via drill 0.3)
  Top 0.15: v34.31,11.02 33.2,11.02 U1.P$AC24 | v39.92,18.22 v37.57,15.86 | TP_SWDIO.TP 44.56,25.84 v43.59,24.87 43.52,24.87 41.24,27.15 40.47,27.15 40.2,27.43 39.44,27.43 J2.2
  Bottom 0.15: v34.31,11.02 37.57,14.27 v37.57,15.86 | v39.92,18.22 39.92,21.2 v43.59,24.87
SWO
  Top 0.15: U1.P$AD22 32.16,10.6 32.3,10.74 32.3,10.81 32.44,10.95 32.79,10.95 33.76,9.98 33.76,8.31 34.17,7.9 TP_SWO.TP
VBAT  (via drill 0.3)  (2 unrouted)
  Top 0.3: v29.95,2.43 29.26,2.43 C27.2 | 41.24,5.06 v40.13,5.06 40.06,5.2 38.33,6.93 38.33,7.83 TP_VBAT.TP | 41.24,5.06 U3.2 | U3.3 41.31,4.65 41.31,4.92 41.24,5.06
  Bottom 0.3: v29.95,2.43 32.58,5.06 v40.13,5.06
VBUS  (via drill 0.3)  (1 unrouted)
  Top 0.3: J4.A9_B4 22.05,29.44 22.05,29.92 22.75,30.61 26.07,30.61 26.76,29.92 26.76,29.44 J4.A4_B9 26.83,29.23 26.83,27.98 26.38,27.53 | 26.38,27.53 23.85,25 22.95,25 22.05,24.1 22.05,23.76 D3.5 | 27.11,10.05 27.11,9.56 26.97,9.42 C21.1 | 27.11,10.05 27.11,10.53 U1.P$AD2 | 30.3,6.03 30.3,6.31 v30.23,6.38 | 30.3,6.03 30.3,5.96 C38.2 | v34.87,6.38 35,6.38 35.42,5.96 C43.1 | v26,5.89 26,5.41 28.22,3.19 28.22,2.98 C42.1 | v27.39,5.89 27.52,5.89 27.66,6.03 30.3,6.03 | v27.04,10.05 27.11,10.05 | 26.38,27.53 31.4,22.51 v32.93,22.51
  Bottom 0.3: v27.39,5.89 v26,5.89 | v27.04,10.05 27.04,9.91 29.67,7.28 29.95,7.28 30.3,6.93 30.3,6.52 v30.23,6.38 v34.87,6.38 35,6.45 36.67,8.11 42.76,8.11 44.63,9.98 44.63,10.39 32.93,22.1 v32.93,22.51
VREG  (via drill 0.3)
  Top 0.3: C24.2 1.07,8.38 1.83,7.62 2.04,7.62 C23.2 2.18,7.62 2.32,7.62 2.53,7.41 4.12,7.41 IC9.A1 4.26,7.35 4.53,7.35 IC9.A2 4.74,7.35 4.95,7.35 IC9.A3 5.09,7.35 5.23,7.35 v5.5,7.07 | 28.77,5.27 29.95,5.27 30.3,4.92 C39.1 | 28.77,5.27 28.29,5.27 IC1.B2 | v23.58,10.6 22.26,10.6 22.19,10.67 TP_VREG.TP | v28.77,5.41 28.77,5.27
  Bottom 0.3: v28.77,5.41 v23.58,10.6 17.9,10.6 14.71,7.41 14.71,7.28 12.91,5.48 11.25,5.48 9.45,3.68 6.89,3.68 5.43,5.13 5.43,6.52 5.5,6.58 v5.5,7.07